# Altium project 智能家居.PrjPCB
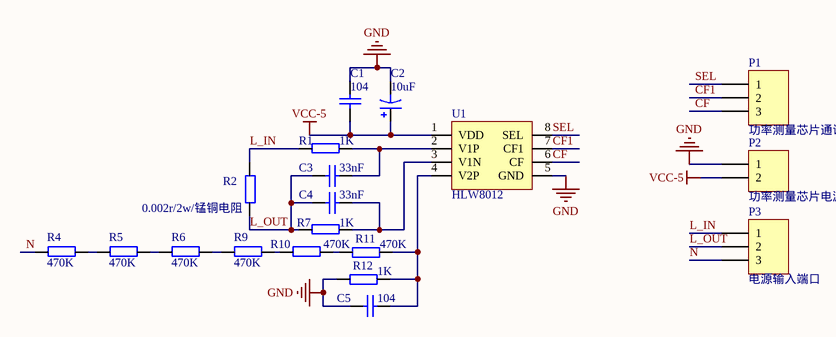
[diagram p0: 智能家居-开关-功率测量板.SchDoc]
10 sheets, 261 parts. Net scope: global (net labels, ports and power ports of the same name join across sheets).
Board files: 智能家居-开关-功率测量板.PcbDoc, 智能家居-开关-按键板.PcbDoc, 智能家居-开关-按键板(红色电容按键).PcbDoc, 智能家居-电灯-电力板.PcbDoc, 智能家居-开关-按键板(蓝色电容按键).PcbDoc, 智能家居-温湿度传感器.PcbDoc, 智能家居-电灯.PcbDoc, 智能家居-开关-电力板.PcbDoc, 智能家居-网关.PcbDoc, 智能家居-窗帘-电力板.PcbDoc, 智能家居-窗帘.PcbDoc, 智能家居-窗帘-控制板.PcbDoc, 智能家居-电灯-主控板.PcbDoc, 智能家居-开关-主控板.PcbDoc
Sheets:
  智能家居-开关-功率测量板.SchDoc
  智能家居-电灯-电力板.SchDoc
  智能家居-电灯-主控板.SchDoc
  智能家居-网关.SchDoc
  智能家居-温湿度传感器.SchDoc
  智能家居-窗帘-电力板.SchDoc
  智能家居-窗帘.SchDoc
  智能家居-窗帘-控制板.SchDoc
  智能家居-开关-电力板.SchDoc
  智能家居-开关-主控板.SchDoc

## Sheet 智能家居-开关-功率测量板.SchDoc
size A4

### Parts
(Parts that share a designator on the sheet are numbered #1, #2 ... from top to bottom, then left to right.)
C1#1  value 104  [0.1UF]  (hidden comment: Cap)
C2#1  value 10uF  [CD5]  (hidden comment: Cap Pol1)
C3#1  value 33nF  [150PF]  (hidden comment: Cap)
C4#1  value 33nF  [150PF]  (hidden comment: Cap)
C5#1  value 104  [0.1UF]  (hidden comment: Cap)
P1#1  功率测量芯片通讯端口  [DG1283]
P2#1  功率测量芯片电源端口  [DG1282]
P3#1  电源输入端口  [JK128-500-3P]
R1#1  1K  [AXIAL-0.3]
R2#1  0.002r/2w/锰铜电阻  [3216]
R4  470K  [AXIAL-0.3]
R5#1  470K  [AXIAL-0.3]
R6#1  470K  [AXIAL-0.3]
R7#1  1K  [AXIAL-0.3]
R9#1  470K  [AXIAL-0.3]
R10#1  470K  [AXIAL-0.3]
R11#1  470K  [AXIAL-0.3]
R12#1  1K  [AXIAL0.3]
U1#1  HLW8012  [SOP-8]

### Nets
GND: C1#1.1 C2#1.2 C5#1.1 P2#1.1 R12#1.1 U1#1.5(GND)
VCC-5: C1#1.2 C2#1.1 P2#1.2 U1#1.1(VDD)
CF: P1#1.3 U1#1.6(CF)
CF1: P1#1.2 U1#1.7(CF1)
L_IN: P3#1.1 R1#1.2 R2#1.2
L_OUT: C3#1.2 C4#1.1 P3#1.2 R2#1.1 R7#1.2
N: P3#1.3 R4.2
SEL: P1#1.1 U1#1.8(SEL)  [project net KM2]
NetC3#1_1: C3#1.1 R1#1.1 U1#1.2(V1P)
NetC4#1_2: C4#1.2 R7#1.1 U1#1.3(V1N)
NetC5#1_2: C5#1.2 R11#1.2 R12#1.2 U1#1.4(V2P)
NetR4_1: R4.1 R5#1.2
NetR5#1_1: R5#1.1 R6#1.2
NetR6#1_1: R6#1.1 R9#1.2
NetR9#1_1: R9#1.1 R10#1.2
NetR10#1_1: R10#1.1 R11#1.1

### Library data of the parts
C1#1 C3#1 C4#1 C5#1 = Cap: Capacitor; Published: 8-Jun-2000; LatestRevisionDate: 17-Jul-2002; LatestRevisionNote: Re-released for DXP Platform.; PackageReference: RAD-0.3; Publisher: Altium Limited; PackageDescription: Radial Cap, Thru-Hole; 2 Leads; 0.3 in Pin Spacing
C2#1 = Cap Pol1: Polarized Capacitor (Radial); Published: 8-Jun-2000; LatestRevisionDate: 17-Jul-2002; LatestRevisionNote: Re-released for DXP Platform.; PackageReference: RB7.6-15; Publisher: Altium Limited; PackageDescription: Polarized Capacitor (Radial); 2 Leads
P1#1 P3#1 = Header 3: Header, 3-Pin; LatestRevisionDate: 17-Jul-2002; LatestRevisionNote: Re-released for DXP Platform.; Publisher: Altium Limited
P2#1 = Header 2: Header, 2-Pin; LatestRevisionDate: 17-Jul-2002; LatestRevisionNote: Re-released for DXP Platform.; Publisher: Altium Limited
R1#1 R2#1 R4 R5#1 R6#1 R7#1 R9#1 R10#1 R11#1 R12#1 = R

## Sheet 智能家居-电灯-电力板.SchDoc
size A4
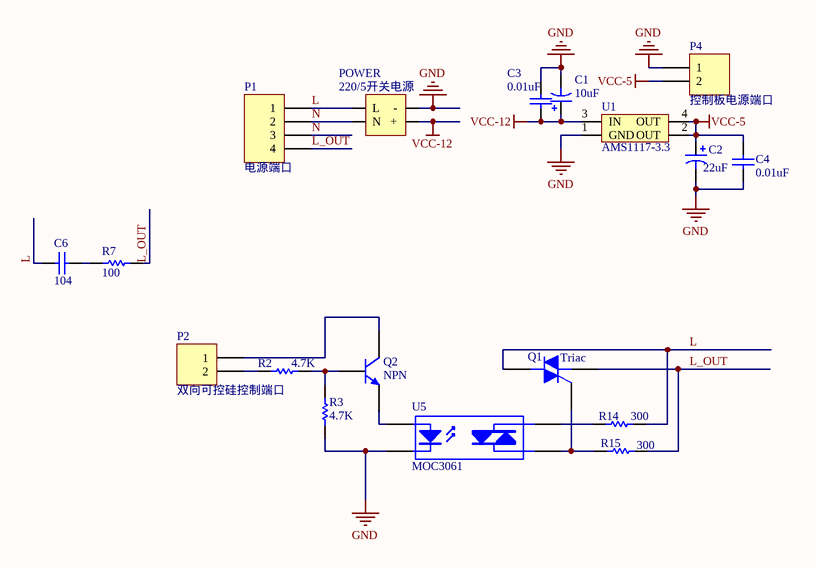
[diagram p1: 智能家居-电灯-电力板.SchDoc]

### Parts
(Parts that share a designator on the sheet are numbered #1, #2 ... from top to bottom, then left to right.)
C1#2  value 10uF  [CD5]  (hidden comment: Cap Pol1)
C2#2  value 22uF  [CD5]  (hidden comment: Cap Pol1)
C3#2  0.01uF  [0.1UF]
C4#2  0.01uF  [0.1UF]
C6#1  value 104  [0.1UF/275V]  (hidden comment: Cap)
P1#2  电源端口  [JK128-500-4P]
P2#2  双向可控硅控制端口  [TJC3-2A]
P4#1  控制板电源端口  [TJC3-2A]
POWER#1  220/5开关电源  [220/5开关电源]
Q1  Triac  [TO-220(2)]
Q2#1  NPN  [TO-92D]
R2#2  4.7K  [AXIAL0.3]
R3#1  4.7K  [AXIAL0.3]
R7#2  100  [AXIAL0.3]
R14#1  300  [AXIAL0.3]
R15#1  300  [AXIAL0.3]
U1#2  AMS1117-3.3  [AMS1117]
U5  MOC3061  [DIP-6N]

### Nets
GND: C1#2.2 C2#2.2 C3#2.2 C4#2.1 P4#1.1 POWER#1.3(-) R3#1.2 U1#2.1(GND) U5.2
VCC-5: C2#2.1 C4#2.2 P4#1.2 U1#2.2(OUT) U1#2.4(OUT)
VCC-12: C1#2.1 C3#2.1 POWER#1.4(+) U1#2.3(IN)
L: C6#1.2 P1#2.1 POWER#1.1(L) Q1.2(M2) R14#1.1
L_OUT: P1#2.4 Q1.1(M1) R7#2.1 R15#1.1
N: P1#2.2 P1#2.3 POWER#1.2(N)
NetC6#1_1: C6#1.1 R7#2.2
NetP2#2_1: P2#2.1 Q2#1.3(C)
NetP2#2_2: P2#2.2 R2#2.1
NetQ1_3: Q1.3(G) R15#1.2 U5.4(A/K)
NetQ2#1_1: Q2#1.1(E) U5.1
NetQ2#1_2: Q2#1.2(B) R2#2.2 R3#1.1
NetR14#1_2: R14#1.2 U5.6

### Library data of the parts
C1#2 C2#2 = Cap Pol1: Polarized Capacitor (Radial); Published: 8-Jun-2000; LatestRevisionDate: 17-Jul-2002; LatestRevisionNote: Re-released for DXP Platform.; PackageReference: RB7.6-15; Publisher: Altium Limited; PackageDescription: Polarized Capacitor (Radial); 2 Leads
C3#2 C4#2 C6#1 = Cap: Capacitor; Published: 8-Jun-2000; LatestRevisionDate: 17-Jul-2002; LatestRevisionNote: Re-released for DXP Platform.; Publisher: Altium Limited; PackageDescription: Radial Cap, Thru-Hole; 2 Leads; 0.3 in Pin Spacing
  C3#2 C4#2: PackageReference: 0.1UF; Value: 0.01uF
  C6#1: PackageReference: RAD-0.3
P1#2 = Header 4: Header, 4-Pin; LatestRevisionDate: 17-Jul-2002; LatestRevisionNote: Re-released for DXP Platform.; Publisher: Altium Limited
P2#2 P4#1 = Header 2: Header, 2-Pin; LatestRevisionDate: 17-Jul-2002; LatestRevisionNote: Re-released for DXP Platform.; Publisher: Altium Limited
Q1 = Triac: Silicon Bidirectional Triode Thyristor; Note: Pin 2 is electrically connected to Pin 4 (TAB); Published: 29-Sep-2000; LatestRevisionDate: 17-Jul-2002; LatestRevisionNote: Re-released for DXP Platform.; DatasheetVersion: 1999; PackageReference: 369-03; Publisher: Altium Limited; PackageDescription: TO, Thru-Hole, Vertical, Heatsink Mounted; 3 In-Line Leads; Pitch 2.28 mm; ComponentLink1Description: Manufacturer Link; ComponentLink1URL: http://www.motorola.com/
Q2#1 = NPN: NPN Bipolar Transistor; Published: 8-Jun-2000; LatestRevisionDate: 17-Jul-2002; LatestRevisionNote: Re-released for DXP Platform.; PackageReference: TO-226-AA; Publisher: Altium Limited; PackageDescription: TO, Flat Index; 3 In-Line, Axial Leads; Body Dia. 4.8mm; Leads 0.55 x 0.51 mm (max); Code_JEDEC: TO-226-AA
R2#2 R3#1 R7#2 R14#1 R15#1 = Res1: Resistor; Value: 1K; Published: 8-Jun-2000; Revision: July-2002: Re-released for DXP Platform.; Publisher: Altium Limited
U1#2 = AMS1117
U5 = OPTOTRIAC

## Sheet 智能家居-电灯-主控板.SchDoc
size A4
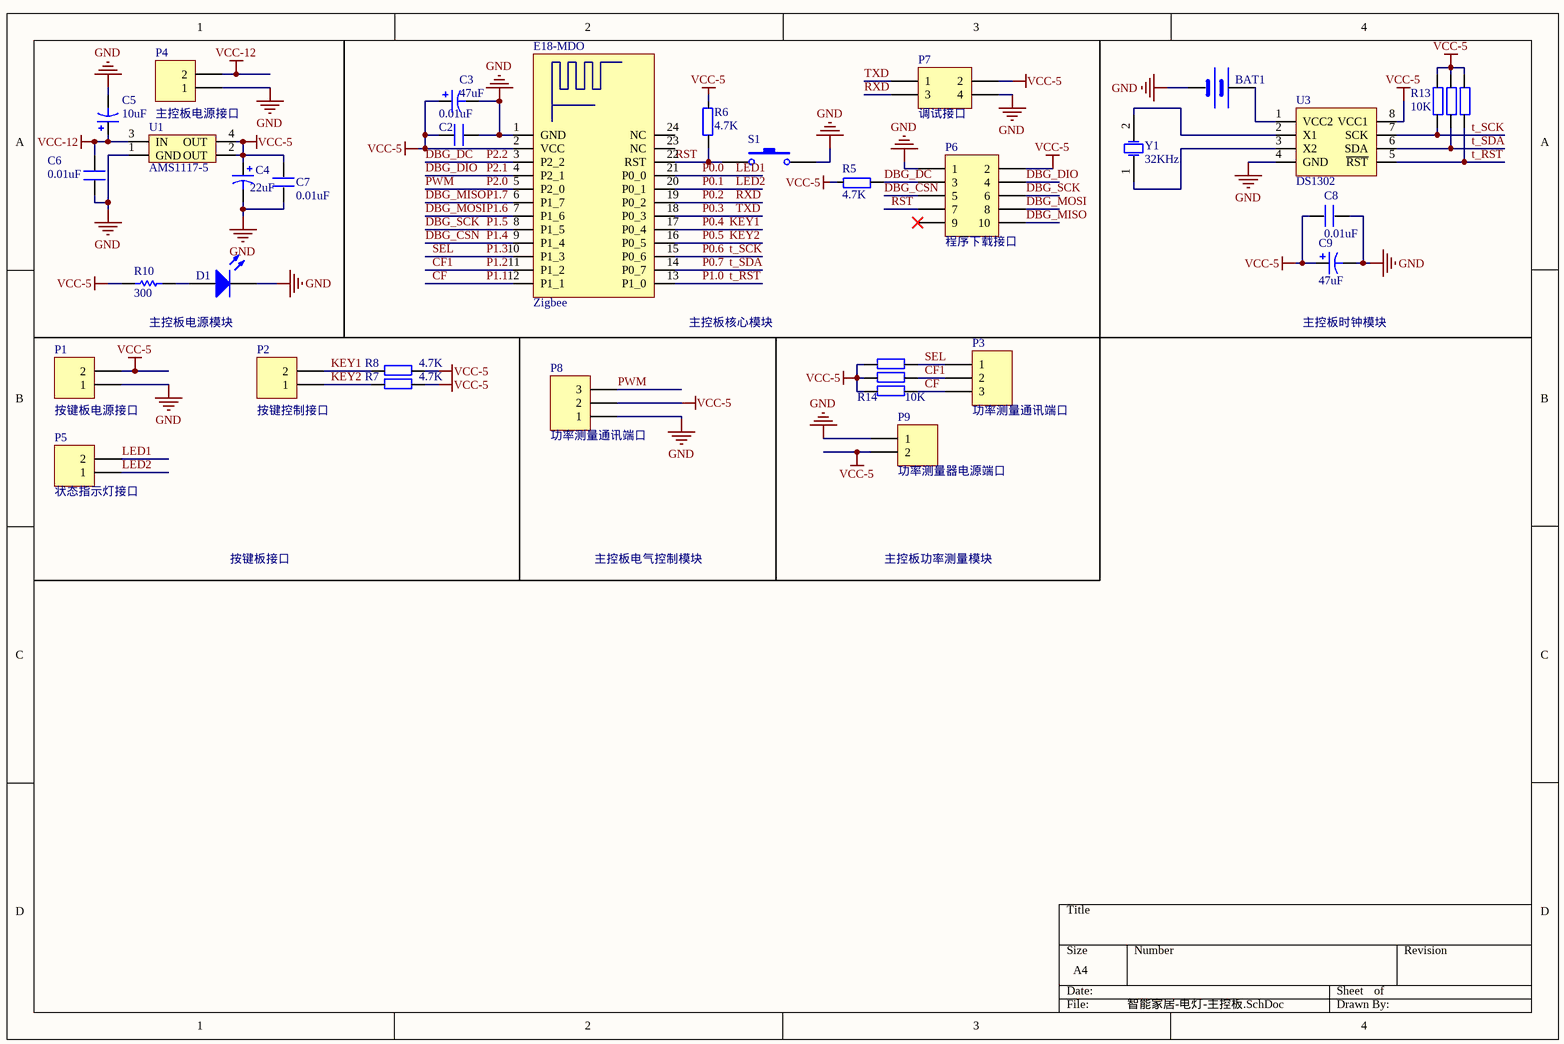
[diagram p2: 智能家居-电灯-主控板.SchDoc]

### Parts
(Parts that share a designator on the sheet are numbered #1, #2 ... from top to bottom, then left to right.)
BAT1#1  BATT  [BATM]  (value not drawn)
C2#3  0.01uF  [0.1UF]
C3#3  value 47uF  [CD5]  (hidden comment: Cap Pol1)
C4#3  value 22uF  [CD5]  (hidden comment: Cap Pol1)
C5#2  value 10uF  [CD5]  (hidden comment: Cap Pol1)
C6#2  0.01uF  [0.1UF]
C7#1  0.01uF  [0.1UF]
C8#1  0.01uF  [0.1UF]
C9#1  value 47uF  [CD5]  (hidden comment: Cap Pol1)
D1#1  LED0  [LED-3]  (value not drawn)
E18-MDO#1  Zigbee  [E18-MD0-1]
P1#3  按键板电源接口  [DG1282]
P2#3  按键控制接口  [DG1282]
P3#2  功率测量通讯端口  [DG1283]
P4#2  主控板电源接口  [DG1282]
P5#1  状态指示灯接口  [DG1282]
P6#1  程序下载接口  [HDR2X5]
P7#1  调试接口  [HDR2X2]
P8#1  功率测量通讯端口  [DG1283]
P9#1  功率测量器电源端口  [DG1282]
R5#2  4.7K  [AXIAL-0.3]
R6#2  4.7K  [AXIAL-0.3]
R7#3  4.7K  [AXIAL-0.3]
R8#1  4.7K  [AXIAL-0.3]
R10#2  value 300  [AXIAL-0.3]  (hidden comment: Res1)
R11#2  10K  [AXIAL-0.3]  (value not drawn)
R12#2  10K  [AXIAL-0.3]  (value not drawn)
R13#1  10K  [AXIAL-0.3]
R14#2  10K  [AXIAL-0.3]
R15#2  10K  [AXIAL-0.3]  (value not drawn)
R16#1  10K  [AXIAL-0.3]  (value not drawn)
S1#1  SW-PB  [KEY_M]  (value not drawn)
U1#3  AMS1117-5  [AMS1117]
U3#1  DS1302  [DIP-8N]
Y1#1  32KHz  [3216]

### Nets
GND: BAT1#1.2(GND) C2#3.2 C3#3.2 C4#3.2 C5#2.2 C6#2.1 C7#1.1 C8#1.2 C9#1.2 D1#1.2(K) E18-MDO#1.1(GND) P1#3.1 P4#2.1 P6#1.1 P7#1.4 P8#1.1 P9#1.1 S1#1.2 U1#3.1(GND) U3#1.4(GND)
VCC-5: C2#3.1 C3#3.1 C4#3.1 C7#1.2 C8#1.1 C9#1.1 E18-MDO#1.2(VCC) P1#3.2 P6#1.2 P7#1.2 P8#1.2 P9#1.2 R5#2.1 R6#2.1 R7#3.1 R8#1.1 R10#2.1 R11#2.2 R12#2.2 R13#1.2 R14#2.2 R15#2.2 R16#1.2 U1#3.2(OUT) U1#3.4(OUT) U3#1.8(VCC1)
VCC-12: C5#2.1 C6#2.2 P4#2.2 U1#3.3(IN)
CF: E18-MDO#1.12(P1_1) E18-MDO#1.16(P0_5) P2#3.1 P3#2.3 R7#3.2 R14#2.1  [also labelled KEY2, P0.5, P1.1]
CF1: E18-MDO#1.11(P1_2) P3#2.2 R15#2.1  [also labelled P1.2]
DBG_CSN: E18-MDO#1.9(P1_4) P6#1.5  [also labelled P1.4]
DBG_DC: E18-MDO#1.3(P2_2) P6#1.3 R5#2.2  [also labelled P2.2]
DBG_DIO: E18-MDO#1.4(P2_1) P6#1.4  [also labelled P2.1]
DBG_MISO: E18-MDO#1.6(P1_7) E18-MDO#1.14(P0_7) P6#1.10 R12#2.1 U3#1.6(SDA)  [also labelled P0.7, P1.7, t_SDA]  [project net Brightness]
DBG_MOSI: E18-MDO#1.7(P1_6) E18-MDO#1.13(P1_0) E18-MDO#1.17(P0_4) P2#3.2 P6#1.8 R8#1.2 R11#2.1 U3#1.5(~{RST})  [also labelled KEY1, P0.4, P1.0, P1.6, t_RST]
DBG_SCK: E18-MDO#1.8(P1_5) P6#1.6  [also labelled P1.5]
LED1: E18-MDO#1.21(P0_0) P5#1.2  [also labelled P0.0]
LED2: E18-MDO#1.20(P0_1) P5#1.1  [also labelled P0.1]
P0.2: E18-MDO#1.19(P0_2) P7#1.3  [also labelled RXD]
P0.3: E18-MDO#1.18(P0_3) P7#1.1  [also labelled TXD]
P0.6: E18-MDO#1.5(P2_0) E18-MDO#1.15(P0_6) P8#1.3 R13#1.1 U3#1.7(SCK)  [also labelled P2.0, PWM, t_SCK]  [project net DO]
P1.3: E18-MDO#1.10(P1_3) P3#2.1 R16#1.1  [also labelled SEL]  [project net KM2]
RST: E18-MDO#1.22(RST) P6#1.7 R6#2.2 S1#1.1
NetBAT1#1_1: BAT1#1.1(VCC) U3#1.1(VCC2)
NetD1#1_1: D1#1.1(A) R10#2.2
NetU3#1_2: U3#1.2(X1) Y1#1.2(OSC2)
NetU3#1_3: U3#1.3(X2) Y1#1.1(OSC1)

Not connected (* = marked no-connect by the designer): E18-MDO#1 23(NC) 24(NC); P6#1 9*

### Notes on the sheet
- 主控板电源模块
- (near E18-MDO#1) 主控板核心模块
- 主控板时钟模块
- 按键板接口
- 主控板电气控制模块
- 主控板功率测量模块

### Library data of the parts
BAT1#1 = BAT
C2#3 C6#2 C7#1 C8#1 = C
C3#3 C4#3 C5#2 C9#1 = Cap Pol1: Polarized Capacitor (Radial); Published: 8-Jun-2000; LatestRevisionDate: 17-Jul-2002; LatestRevisionNote: Re-released for DXP Platform.; PackageReference: RB7.6-15; Publisher: Altium Limited; PackageDescription: Polarized Capacitor (Radial); 2 Leads
D1#1 = LED0: Typical INFRARED GaAs LED; Published: 8-Jun-2000; LatestRevisionDate: 08-Jul-2005; LatestRevisionNote: Mech Layer 1 removed.; PackageReference: LED-0; Publisher: Altium Limited; PackageDescription: LED; 2 Leads
E18-MDO#1 = E18-MDO: Zigbee模块
P1#3 P2#3 P4#2 P5#1 P9#1 = Header 2H: Header, 2-Pin, Right Angle; LatestRevisionDate: 17-Jul-2002; LatestRevisionNote: Re-released for DXP Platform.; Publisher: Altium Limited
P3#2 P8#1 = Header 3: Header, 3-Pin; LatestRevisionDate: 17-Jul-2002; LatestRevisionNote: Re-released for DXP Platform.; Publisher: Altium Limited
P6#1 = Header 5X2: Header, 5-Pin, Dual row; LatestRevisionDate: 17-Jul-2002; LatestRevisionNote: Re-released for DXP Platform.; Publisher: Altium Limited
P7#1 = Header 2X2H: Header, 2-Pin, Dual row, Right Angle; LatestRevisionDate: 17-Jul-2002; LatestRevisionNote: Re-released for DXP Platform.; Publisher: Altium Limited
R5#2 R6#2 R7#3 R8#1 R11#2 R12#2 R13#1 R14#2 R15#2 R16#1 = R
R10#2 = Res1: Resistor; Published: 8-Jun-2000; LatestRevisionDate: 17-Jul-2002; LatestRevisionNote: Re-released for DXP Platform.; PackageReference: AXIAL-0.3; Publisher: Altium Limited; PackageDescription: Axial Device, Thru-Hole; 2 Leads; 0.3 in Pin Spacing
S1#1 = SW-PB: Switch; Published: 24-Mar-1999; LatestRevisionDate: 17-Jul-2002; LatestRevisionNote: Re-released for DXP Platform.; PackageReference: SPST-2; Publisher: Altium Limited; PackageDescription: Switch; 2 Leads
U1#3 = AMS1117
Y1#1 = XTAL: Crystal Oscillator; Published: 8-Jun-2000; LatestRevisionDate: 17-Jul-2002; LatestRevisionNote: Re-released for DXP Platform.; PackageReference: R38; Publisher: Altium Limited; PackageDescription: Crystal, Thru-Hole; 2 Leads; Body 3.1 x 8.2 mm (Dia.xH)

## Sheet 智能家居-网关.SchDoc
size A4
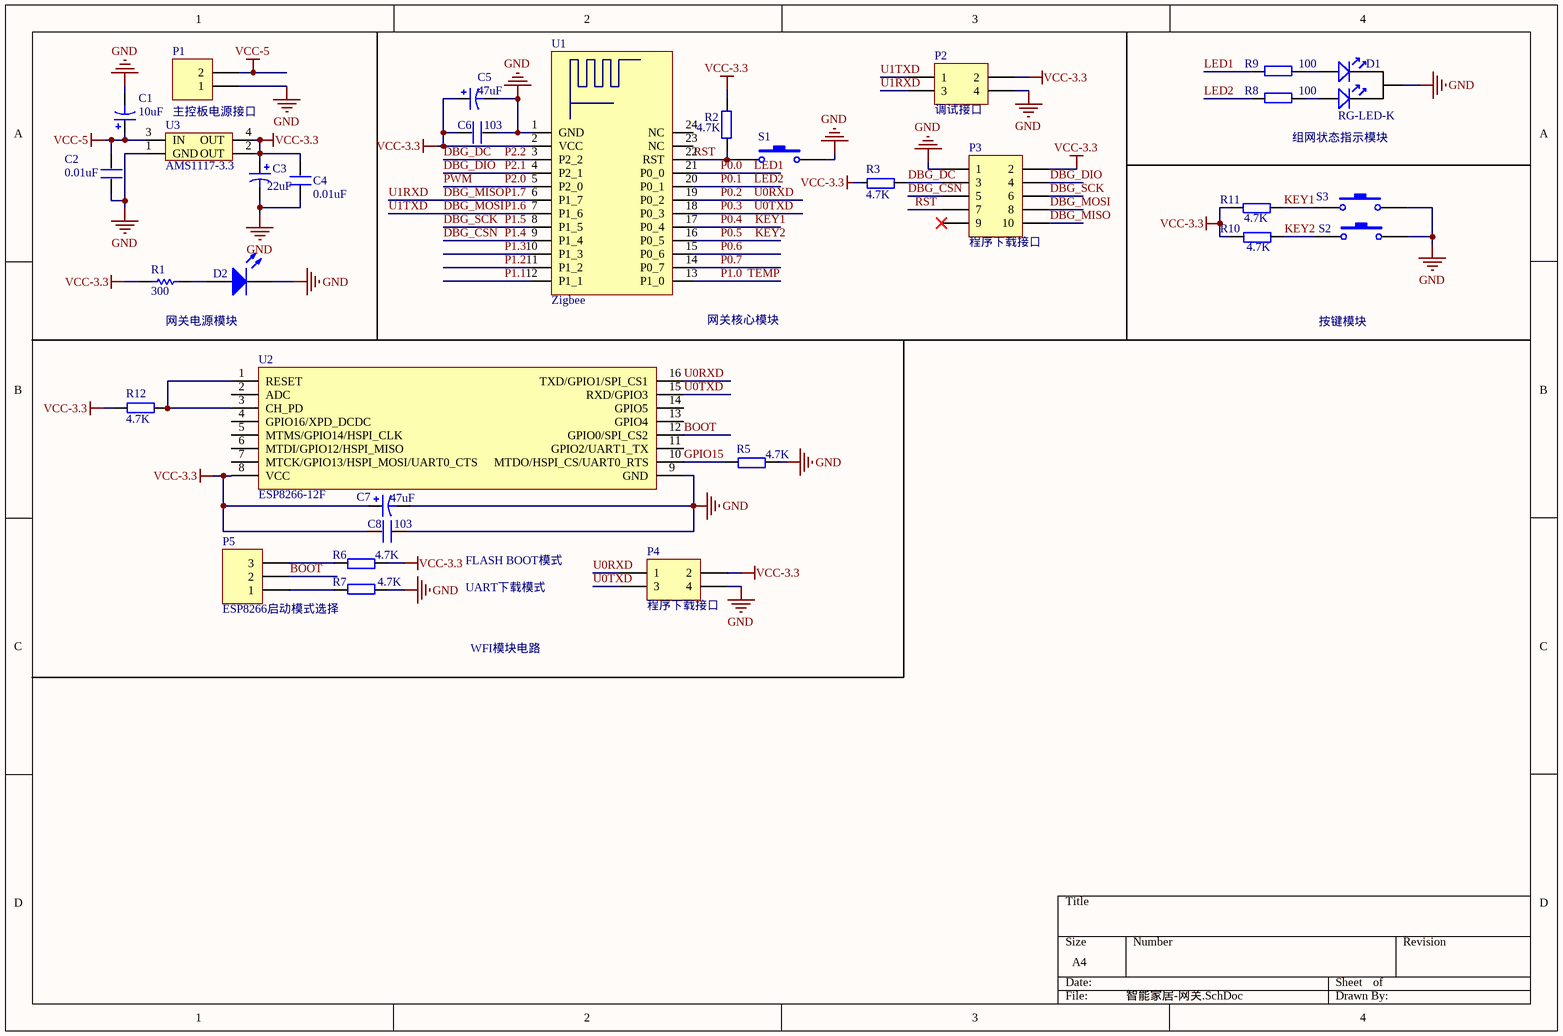
[diagram p3: 智能家居-网关.SchDoc]

### Parts
(Parts that share a designator on the sheet are numbered #1, #2 ... from top to bottom, then left to right.)
C1#3  value 10uF  [CD5]  (hidden comment: Cap Pol1)
C2#4  0.01uF  [0.1UF]
C3#4  value 22uF  [CD5]  (hidden comment: Cap Pol1)
C4#4  0.01uF  [0.1UF]
C5#3  value 47uF  [CD5]  (hidden comment: Cap Pol1)
C6#3  103  [0.1UF]
C7#2  value 47uF  [CD5]  (hidden comment: Cap Pol1)
C8#2  103  [0.1UF]
D1#2  RG-LED-K  [RG-LED]
D2#1  LED0  [LED-3]  (value not drawn)
P1#4  主控板电源接口  [DG1282]
P2#4  调试接口  [HDR2X2]
P3#3  程序下载接口  [HDR2X5]
P4#3  程序下载接口  [HDR2X2]
P5#2  ESP8266启动模式选择  [HDR1X3]
R1#2  value 300  [AXIAL-0.3]  (hidden comment: Res1)
R2#3  4.7K  [AXIAL-0.3]
R3#2  4.7K  [AXIAL-0.3]
R5#3  4.7K  [AXIAL-0.3]
R6#3  4.7K  [AXIAL-0.3]
R7#4  4.7K  [AXIAL-0.3]
R8#2  100  [AXIAL-0.3]
R9#2  100  [AXIAL-0.3]
R10#3  4.7K  [AXIAL-0.3]
R11#3  4.7K  [AXIAL-0.3]
R12#3  4.7K  [AXIAL-0.3]
S1#2  SW-PB  [KEY_M]  (value not drawn)
S2#1  SW-PB  [KEY_M]  (value not drawn)
S3  SW-PB  [KEY_M]  (value not drawn)
U1#4  Zigbee  [E18-MD0-1]
U2#1  ESP8266-12F  [ESP8266 - 12S]
U3#2  AMS1117-3.3  [AMS1117]

### Nets
GND: C1#3.2 C2#4.1 C3#4.2 C4#4.1 C5#3.2 C6#3.2 C7#2.2 C8#2.2 D1#2.2(GND) D2#1.2(K) P1#4.1 P2#4.4 P3#3.1 P4#3.4 R5#3.2 R7#4.1 S1#2.2 S2#1.2 S3.2 U1#4.1(GND) U2#1.9(GND) U3#2.1(GND)
VCC-3.3: C3#4.1 C4#4.2 C5#3.1 C6#3.1 C7#2.1 C8#2.1 P2#4.2 P3#3.2 P4#3.2 R1#2.1 R2#3.1 R3#2.1 R6#3.2 R10#3.1 R11#3.1 R12#3.2 U1#4.2(VCC) U2#1.8(VCC) U3#2.2(OUT) U3#2.4(OUT)
VCC-5: C1#3.1 C2#4.2 P1#4.2 U3#2.3(IN)
BOOT: P5#2.2 U2#1.12(GPIO0/SPI_CS2)
DBG_CSN: P3#3.5 U1#4.9(P1_4)  [also labelled P1.4]
DBG_DC: P3#3.3 R3#2.2 U1#4.3(P2_2)  [also labelled P2.2]
DBG_DIO: P3#3.4 U1#4.4(P2_1)  [also labelled P2.1]
DBG_MISO: P2#4.3 P3#3.10 U1#4.6(P1_7) U1#4.14(P0_7)  [also labelled P0.7, P1.7, U1RXD]  [project net Brightness]
DBG_MOSI: P2#4.1 P3#3.8 R11#3.2 S3.1 U1#4.7(P1_6) U1#4.13(P1_0) U1#4.17(P0_4)  [also labelled KEY1, P0.4, P1.0, P1.6, TEMP, U1TXD]
DBG_SCK: P3#3.6 U1#4.8(P1_5)  [also labelled P1.5]
GPIO15: R5#3.1 U2#1.10(MTDO/HSPI_CS/UART0_RTS)
KEY2: R10#3.2 S2#1.1 U1#4.12(P1_1) U1#4.16(P0_5)  [also labelled P0.5, P1.1]  [project net CF]
LED1: R9#2.2 U1#4.21(P0_0)  [also labelled P0.0]
LED2: R8#2.2 U1#4.20(P0_1)  [also labelled P0.1]
P0.2: P4#3.1 U1#4.19(P0_2) U2#1.16(TXD/GPIO1/SPI_CS1)  [also labelled U0RXD]
P0.3: P4#3.3 U1#4.18(P0_3) U2#1.15(RXD/GPIO3)  [also labelled U0TXD]
P0.6: U1#4.5(P2_0) U1#4.15(P0_6)  [also labelled P2.0, PWM]  [project net DO]
P1.2: U1#4.11(P1_2)  [project net CF1]
P1.3: U1#4.10(P1_3)  [project net KM2]
RST: P3#3.7 R2#3.2 S1#2.1 U1#4.22(RST)
NetD1#2_1: D1#2.1(R) R9#2.1
NetD1#2_3: D1#2.3(G) R8#2.1
NetD2#1_1: D2#1.1(A) R1#2.2
NetP5#2_1: P5#2.1 R7#4.2
NetP5#2_3: P5#2.3 R6#3.1
NetR12#3_1: R12#3.1 U2#1.1(RESET) U2#1.3(CH_PD)

Not connected (* = marked no-connect by the designer): P3#3 9*; U1#4 23(NC) 24(NC); U2#1 2(ADC) 4(GPIO16/XPD_DCDC) 5(MTMS/GPIO14/HSPI_CLK) 6(MTDI/GPIO12/HSPI_MISO) 7(MTCK/GPIO13/HSPI_MOSI/UART0_CTS) 11(GPIO2/UART1_TX) 13(GPIO4) 14(GPIO5)

### Notes on the sheet
- 组网状态指示模块
- 网关电源模块
- 网关核心模块
- 按键模块
- FLASH BOOT模式
- UART下载模式
- WFI模块电路

### Library data of the parts
C1#3 C3#4 C5#3 C7#2 = Cap Pol1: Polarized Capacitor (Radial); Published: 8-Jun-2000; LatestRevisionDate: 17-Jul-2002; LatestRevisionNote: Re-released for DXP Platform.; PackageReference: RB7.6-15; Publisher: Altium Limited; PackageDescription: Polarized Capacitor (Radial); 2 Leads
C2#4 C4#4 C6#3 C8#2 = C
D2#1 = LED0: Typical INFRARED GaAs LED; Published: 8-Jun-2000; LatestRevisionDate: 08-Jul-2005; LatestRevisionNote: Mech Layer 1 removed.; PackageReference: LED-0; Publisher: Altium Limited; PackageDescription: LED; 2 Leads
P1#4 = Header 2H: Header, 2-Pin, Right Angle; LatestRevisionDate: 17-Jul-2002; LatestRevisionNote: Re-released for DXP Platform.; Publisher: Altium Limited
P2#4 P4#3 = Header 2X2H: Header, 2-Pin, Dual row, Right Angle; LatestRevisionDate: 17-Jul-2002; LatestRevisionNote: Re-released for DXP Platform.; Publisher: Altium Limited
P3#3 = Header 5X2: Header, 5-Pin, Dual row; LatestRevisionDate: 17-Jul-2002; LatestRevisionNote: Re-released for DXP Platform.; Publisher: Altium Limited
P5#2 = Header 3: Header, 3-Pin; LatestRevisionDate: 17-Jul-2002; LatestRevisionNote: Re-released for DXP Platform.; Publisher: Altium Limited
R1#2 = Res1: Resistor; Published: 8-Jun-2000; LatestRevisionDate: 17-Jul-2002; LatestRevisionNote: Re-released for DXP Platform.; PackageReference: AXIAL-0.3; Publisher: Altium Limited; PackageDescription: Axial Device, Thru-Hole; 2 Leads; 0.3 in Pin Spacing
R2#3 R3#2 R5#3 R6#3 R7#4 R8#2 R9#2 R10#3 R11#3 R12#3 = R
S1#2 S2#1 S3 = SW-PB: Switch; Published: 24-Mar-1999; LatestRevisionDate: 17-Jul-2002; LatestRevisionNote: Re-released for DXP Platform.; PackageReference: SPST-2; Publisher: Altium Limited; PackageDescription: Switch; 2 Leads
U1#4 = E18-MDO: Zigbee模块
U2#1 = ESP8266_12S
U3#2 = AMS1117

## Sheet 智能家居-温湿度传感器.SchDoc
size A4
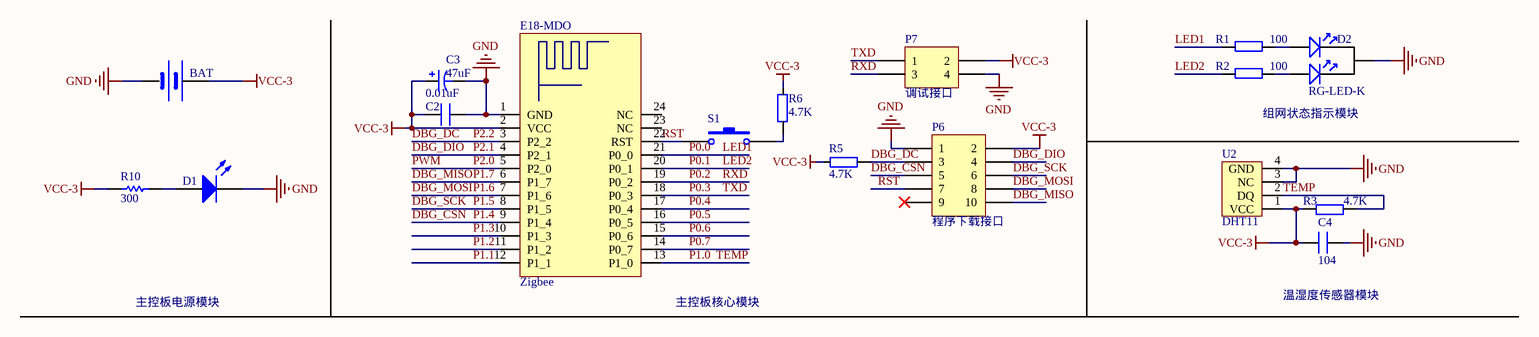
[diagram p4: 智能家居-温湿度传感器.SchDoc]

### Parts
(Parts that share a designator on the sheet are numbered #1, #2 ... from top to bottom, then left to right.)
BAT#1  BATT  [BATM]  (value not drawn)
C2#5  0.01uF  [0.1UF]
C3#5  value 47uF  [CD5]  (hidden comment: Cap Pol1)
C4#5  104  [0.1UF]
D1#3  LED0  [LED-3]  (value not drawn)
D2#2  RG-LED-K  [RG-LED]
E18-MDO#2  Zigbee  [E18-MD0-1]
P6#2  程序下载接口  [HDR2X5]
P7#2  调试接口  [HDR2X2]
R1#3  100  [AXIAL-0.3]
R2#4  100  [AXIAL-0.3]
R3#3  4.7K  [AXIAL-0.3]
R5#4  4.7K  [AXIAL-0.3]
R6#4  4.7K  [AXIAL-0.3]
R10#4  value 300  [AXIAL-0.3]  (hidden comment: Res1)
S1#3  SW-PB  [KEY_M]  (value not drawn)
U2#2  DHT11  [HDR1X4]

### Nets
GND: BAT#1.2(GND) C2#5.2 C3#5.2 C4#5.1 D1#3.2(K) D2#2.2(GND) E18-MDO#2.1(GND) P6#2.1 P7#2.4 U2#2.3(NC) U2#2.4(GND)
VCC-3: BAT#1.1(VCC) C2#5.1 C3#5.1 C4#5.2 E18-MDO#2.2(VCC) P6#2.2 P7#2.2 R3#3.1 R5#4.1 R6#4.1 R10#4.1 U2#2.1(VCC)
DBG_CSN: E18-MDO#2.9(P1_4) P6#2.5  [also labelled P1.4]
DBG_DC: E18-MDO#2.3(P2_2) P6#2.3 R5#4.2  [also labelled P2.2]
DBG_DIO: E18-MDO#2.4(P2_1) P6#2.4  [also labelled P2.1]
DBG_MISO: E18-MDO#2.6(P1_7) E18-MDO#2.14(P0_7) P6#2.10  [also labelled P0.7, P1.7]  [project net Brightness]
DBG_MOSI: E18-MDO#2.7(P1_6) E18-MDO#2.13(P1_0) E18-MDO#2.17(P0_4) P6#2.8 R3#3.2 U2#2.2(DQ)  [also labelled P0.4, P1.0, P1.6, TEMP]
DBG_SCK: E18-MDO#2.8(P1_5) P6#2.6  [also labelled P1.5]
LED1: E18-MDO#2.21(P0_0) R1#3.2  [also labelled P0.0]
LED2: E18-MDO#2.20(P0_1) R2#4.2  [also labelled P0.1]
P0.2: E18-MDO#2.19(P0_2) P7#2.3  [also labelled RXD]
P0.3: E18-MDO#2.18(P0_3) P7#2.1  [also labelled TXD]
P0.5: E18-MDO#2.12(P1_1) E18-MDO#2.16(P0_5)  [also labelled P1.1]  [project net CF]
P0.6: E18-MDO#2.5(P2_0) E18-MDO#2.15(P0_6)  [also labelled P2.0, PWM]  [project net DO]
P1.2: E18-MDO#2.11(P1_2)  [project net CF1]
P1.3: E18-MDO#2.10(P1_3)  [project net KM2]
RST: E18-MDO#2.22(RST) P6#2.7 S1#3.1
NetD1#3_1: D1#3.1(A) R10#4.2
NetD2#2_1: D2#2.1(R) R1#3.1
NetD2#2_3: D2#2.3(G) R2#4.1
NetR6#4_2: R6#4.2 S1#3.2

Not connected (* = marked no-connect by the designer): E18-MDO#2 23(NC) 24(NC); P6#2 9*

### Notes on the sheet
- 组网状态指示模块
- (near C4#5) 温湿度传感器模块
- 主控板电源模块
- (near E18-MDO#2) 主控板核心模块

### Library data of the parts
BAT#1 = BAT
C2#5 C4#5 = C
C3#5 = Cap Pol1: Polarized Capacitor (Radial); Published: 8-Jun-2000; LatestRevisionDate: 17-Jul-2002; LatestRevisionNote: Re-released for DXP Platform.; PackageReference: RB7.6-15; Publisher: Altium Limited; PackageDescription: Polarized Capacitor (Radial); 2 Leads
D1#3 = LED0: Typical INFRARED GaAs LED; Published: 8-Jun-2000; LatestRevisionDate: 08-Jul-2005; LatestRevisionNote: Mech Layer 1 removed.; PackageReference: LED-0; Publisher: Altium Limited; PackageDescription: LED; 2 Leads
E18-MDO#2 = E18-MDO: Zigbee模块
P6#2 = Header 5X2: Header, 5-Pin, Dual row; LatestRevisionDate: 17-Jul-2002; LatestRevisionNote: Re-released for DXP Platform.; Publisher: Altium Limited
P7#2 = Header 2X2H: Header, 2-Pin, Dual row, Right Angle; LatestRevisionDate: 17-Jul-2002; LatestRevisionNote: Re-released for DXP Platform.; Publisher: Altium Limited
R1#3 R2#4 R3#3 R5#4 R6#4 = R
R10#4 = Res1: Resistor; Published: 8-Jun-2000; LatestRevisionDate: 17-Jul-2002; LatestRevisionNote: Re-released for DXP Platform.; PackageReference: AXIAL-0.3; Publisher: Altium Limited; PackageDescription: Axial Device, Thru-Hole; 2 Leads; 0.3 in Pin Spacing
S1#3 = SW-PB: Switch; Published: 24-Mar-1999; LatestRevisionDate: 17-Jul-2002; LatestRevisionNote: Re-released for DXP Platform.; PackageReference: SPST-2; Publisher: Altium Limited; PackageDescription: Switch; 2 Leads
U2#2 = DHT11: 数字温湿度传感器

## Sheet 智能家居-窗帘-电力板.SchDoc
size A4
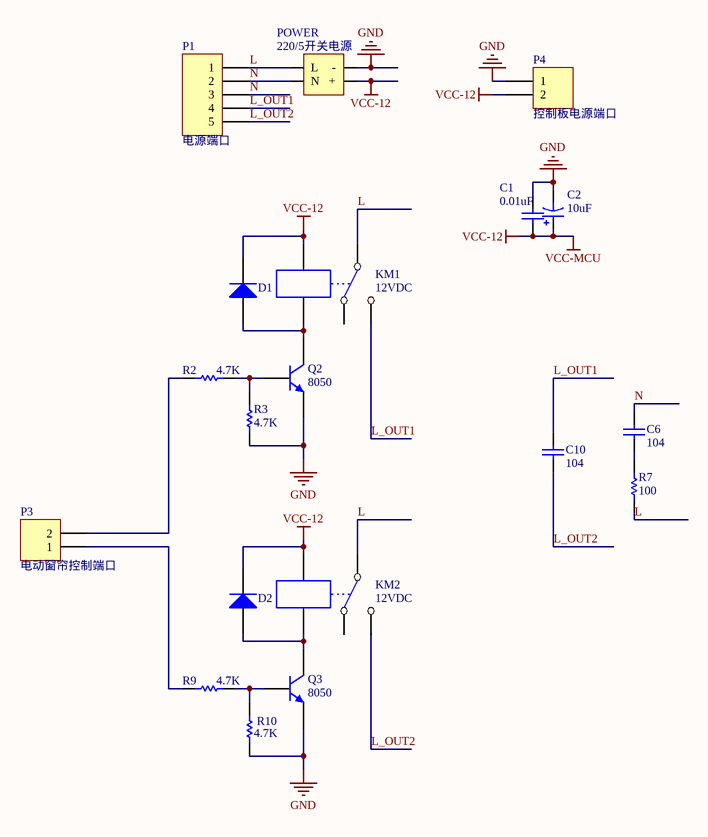
[diagram p5: 智能家居-窗帘-电力板.SchDoc]

### Parts
(Parts that share a designator on the sheet are numbered #1, #2 ... from top to bottom, then left to right.)
C1#4  0.01uF  [0.1UF]
C2#6  value 10uF  [CD5]  (hidden comment: Cap Pol1)
C6#4  value 104  [0.1UF/275V]  (hidden comment: Cap)
C10#1  value 104  [0.1UF/275V]  (hidden comment: Cap)
D1#4  Diode  [DIODE]  (value not drawn)
D2#3  Diode  [DIODE]  (value not drawn)
KM1  12VDC  [SRD_RELAY]
KM2  12VDC  [SRD_RELAY]
P1#5  电源端口  [JK128-500-5P]
P3#4  电动窗帘控制端口  [TJC3-2A]
P4#4  控制板电源端口  [TJC3-2A]
POWER#2  220/5开关电源  [220/5开关电源]
Q2#2  8050  [TO-92D]
Q3  8050  [TO-92D]
R2#5  4.7K  [AXIAL0.3]
R3#4  4.7K  [AXIAL0.3]
R7#5  100  [AXIAL0.3]
R9#3  4.7K  [AXIAL0.3]
R10#5  4.7K  [AXIAL0.3]

### Nets
GND: C1#4.2 C2#6.2 P4#4.1 POWER#2.3(-) Q2#2.1(E) Q3.1(E) R3#4.2 R10#5.2
VCC-12: C1#4.1 C2#6.1 D1#4.2(K) D2#3.2(K) KM1.1 KM2.1 P4#4.2 POWER#2.4(+)  [also labelled VCC-MCU]
L: KM1.5(COM) KM2.5(COM) P1#5.1 POWER#2.1(L) R7#5.1
L_OUT1: C10#1.2 KM1.3 P1#5.4
L_OUT2: C10#1.1 KM2.3 P1#5.5
N: C6#4.2 P1#5.2 P1#5.3 POWER#2.2(N)
NetC6#4_1: C6#4.1 R7#5.2
NetD1#4_1: D1#4.1(A) KM1.4 Q2#2.3(C)
NetD2#3_1: D2#3.1(A) KM2.4 Q3.3(C)
NetP3#4_1: P3#4.1 R9#3.1
NetP3#4_2: P3#4.2 R2#5.1
NetQ2#2_2: Q2#2.2(B) R2#5.2 R3#4.1
NetQ3_2: Q3.2(B) R9#3.2 R10#5.1

Not connected (* = marked no-connect by the designer): KM1 2; KM2 2

### Library data of the parts
C1#4 C6#4 C10#1 = Cap: Capacitor; Published: 8-Jun-2000; LatestRevisionDate: 17-Jul-2002; LatestRevisionNote: Re-released for DXP Platform.; Publisher: Altium Limited; PackageDescription: Radial Cap, Thru-Hole; 2 Leads; 0.3 in Pin Spacing
  C1#4: PackageReference: 0.1UF; Value: 0.01uF
  C6#4 C10#1: PackageReference: RAD-0.3
C2#6 = Cap Pol1: Polarized Capacitor (Radial); Published: 8-Jun-2000; LatestRevisionDate: 17-Jul-2002; LatestRevisionNote: Re-released for DXP Platform.; PackageReference: RB7.6-15; Publisher: Altium Limited; PackageDescription: Polarized Capacitor (Radial); 2 Leads
D1#4 D2#3 = Diode: Default Diode; Published: 8-Jun-2000; LatestRevisionDate: 17-Jul-2002; LatestRevisionNote: Re-released for DXP Platform.; PackageVersion: Sep-1996; PackageReference: SMC; Publisher: Altium Limited; PackageDescription: DO-214-AB/SMC; 2 C-Bend Leads; Body 7.9 x 5.9 mm, inc. leads (LxW); Code_JEDEC: DO-214-AB
KM1 KM2 = SRD-12VDC
P1#5 = Header 5: Header, 5-Pin; LatestRevisionDate: 17-Jul-2002; LatestRevisionNote: Re-released for DXP Platform.; Publisher: Altium Limited
P3#4 P4#4 = Header 2: Header, 2-Pin; LatestRevisionDate: 17-Jul-2002; LatestRevisionNote: Re-released for DXP Platform.; Publisher: Altium Limited
Q2#2 Q3 = NPN: NPN Bipolar Transistor; Published: 8-Jun-2000; LatestRevisionDate: 17-Jul-2002; LatestRevisionNote: Re-released for DXP Platform.; PackageReference: TO-226-AA; Publisher: Altium Limited; PackageDescription: TO, Flat Index; 3 In-Line, Axial Leads; Body Dia. 4.8mm; Leads 0.55 x 0.51 mm (max); Code_JEDEC: TO-226-AA
R2#5 R3#4 R7#5 R9#3 R10#5 = Res1: Resistor; Value: 1K; Published: 8-Jun-2000; Revision: July-2002: Re-released for DXP Platform.; Publisher: Altium Limited

## Sheet 智能家居-窗帘.SchDoc
size A4
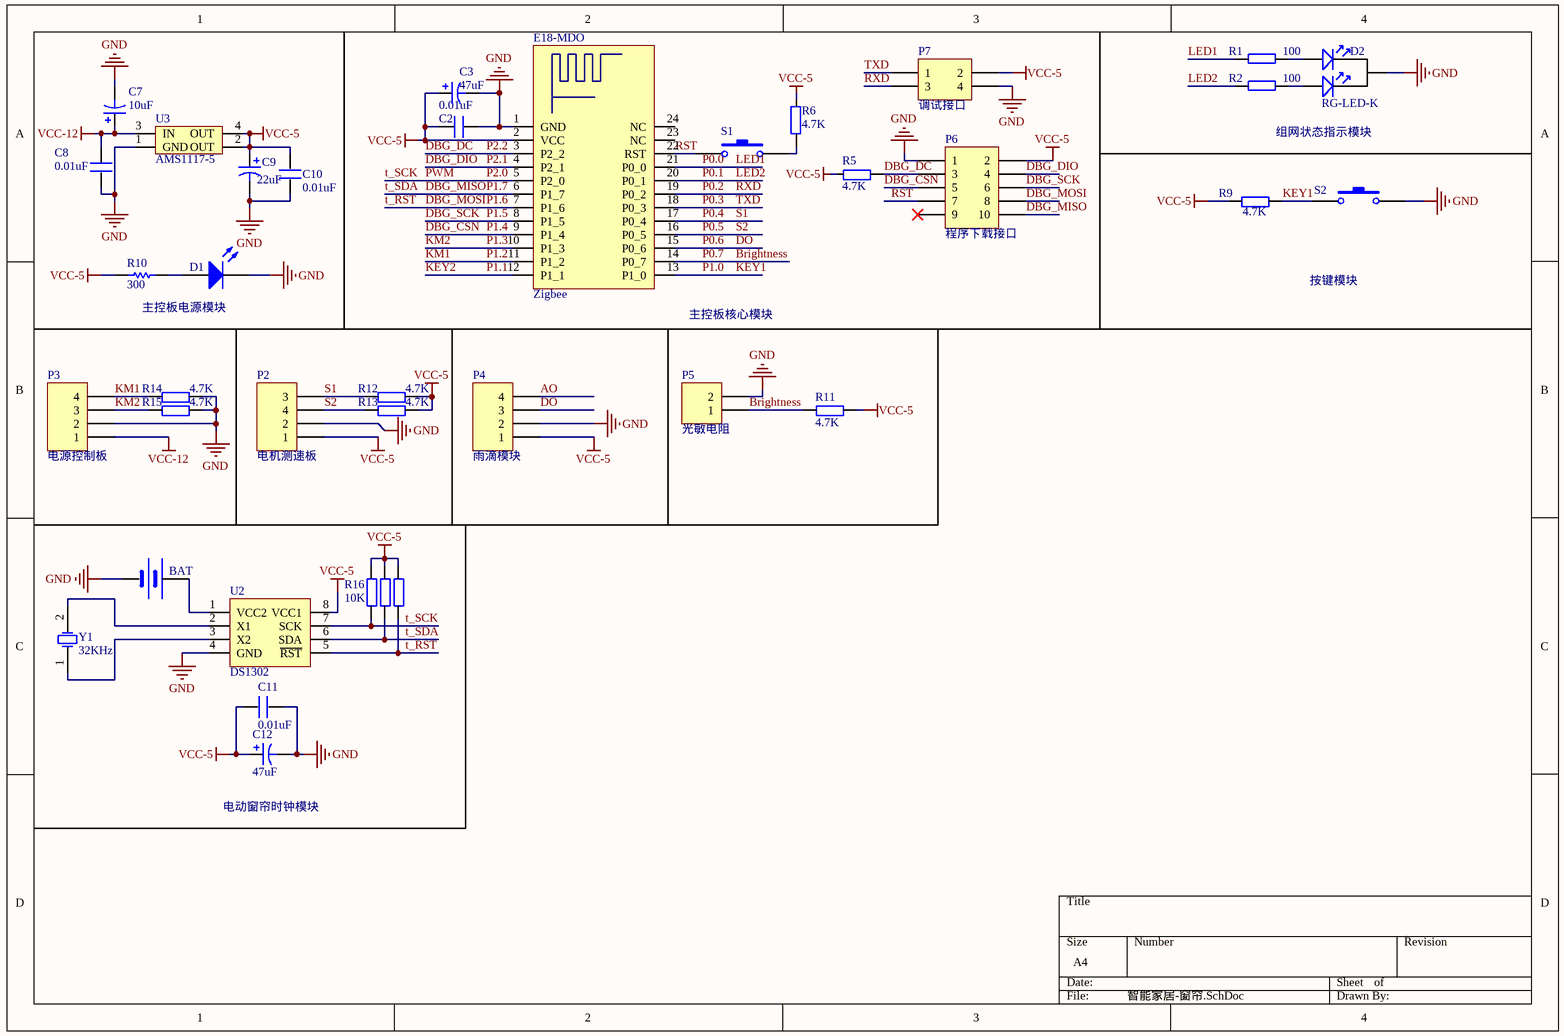
[diagram p6: 智能家居-窗帘.SchDoc]

### Parts
(Parts that share a designator on the sheet are numbered #1, #2 ... from top to bottom, then left to right.)
BAT#2  BATT  [BATM]  (value not drawn)
C2#7  0.01uF  [0.1UF]
C3#6  value 47uF  [CD5]  (hidden comment: Cap Pol1)
C7#3  value 10uF  [CD5]  (hidden comment: Cap Pol1)
C8#3  0.01uF  [0.1UF]
C9#2  value 22uF  [CD5]  (hidden comment: Cap Pol1)
C10#2  0.01uF  [0.1UF]
C11#1  0.01uF  [0.1UF]
C12#1  value 47uF  [CD5]  (hidden comment: Cap Pol1)
D1#5  LED0  [LED-3]  (value not drawn)
D2#4  RG-LED-K  [RG-LED]
E18-MDO#3  Zigbee  [E18-MD0-1]
P2#5  电机测速板  [HDR1X4]
P3#5  电源控制板  [HDR1X4]
P4#5  雨滴模块  [DG1284]
P5#3  光敏电阻  [HDR1X2]
P6#3  程序下载接口  [HDR2X5]
P7#3  调试接口  [HDR2X2]
R1#4  100  [AXIAL-0.3]
R2#6  100  [AXIAL-0.3]
R5#5  4.7K  [AXIAL-0.3]
R6#5  4.7K  [AXIAL-0.3]
R9#4  4.7K  [AXIAL-0.3]
R10#6  value 300  [AXIAL-0.3]  (hidden comment: Res1)
R11#4  4.7K  [AXIAL-0.3]
R12#4  4.7K  [AXIAL-0.4]
R13#2  4.7K  [AXIAL-0.4]
R14#3  4.7K  [AXIAL-0.3]
R15#3  4.7K  [AXIAL-0.3]
R16#2  10K  [AXIAL-0.3]
R17#1  10K  [AXIAL-0.3]  (value not drawn)
R18#1  10K  [AXIAL-0.3]  (value not drawn)
S1#4  SW-PB  [KEY_M]  (value not drawn)
S2#2  SW-PB  [KEY_M]  (value not drawn)
U2#3  DS1302  [DIP-8N]
U3#3  AMS1117-5  [AMS1117]
Y1#2  32KHz  [3216]

### Nets
GND: BAT#2.2(GND) C2#7.2 C3#6.2 C7#3.2 C8#3.1 C9#2.2 C10#2.1 C11#1.2 C12#1.2 D1#5.2(K) D2#4.2(GND) E18-MDO#3.1(GND) P2#5.2 P3#5.2 P4#5.2 P5#3.2 P6#3.1 P7#3.4 R14#3.2 R15#3.2 S2#2.2 U2#3.4(GND) U3#3.1(GND)
VCC-5: C2#7.1 C3#6.1 C9#2.1 C10#2.2 C11#1.1 C12#1.1 E18-MDO#3.2(VCC) P2#5.1 P4#5.1 P6#3.2 P7#3.2 R5#5.1 R6#5.1 R9#4.1 R10#6.1 R11#4.2 R12#4.2 R13#2.2 R16#2.2 R17#1.2 R18#1.2 U2#3.8(VCC1) U3#3.2(OUT) U3#3.4(OUT)
VCC-12: C7#3.1 C8#3.2 P3#5.1 U3#3.3(IN)
AO: P4#5.4
Brightness: E18-MDO#3.6(P1_7) E18-MDO#3.14(P0_7) P5#3.1 P6#3.10 R11#4.1 R17#1.1 U2#3.6(SDA)  [also labelled DBG_MISO, P0.7, P1.7, t_SDA]
DBG_CSN: E18-MDO#3.9(P1_4) P6#3.5  [also labelled P1.4]
DBG_DC: E18-MDO#3.3(P2_2) P6#3.3 R5#5.2  [also labelled P2.2]
DBG_DIO: E18-MDO#3.4(P2_1) P6#3.4  [also labelled P2.1]
DBG_MOSI: E18-MDO#3.7(P1_6) E18-MDO#3.13(P1_0) E18-MDO#3.17(P0_4) P2#5.3 P6#3.8 R9#4.2 R12#4.1 R18#1.1 S2#2.1 U2#3.5(~{RST})  [also labelled KEY1, P0.4, P1.0, P1.6, S1, t_RST]
DBG_SCK: E18-MDO#3.8(P1_5) P6#3.6  [also labelled P1.5]
DO: E18-MDO#3.5(P2_0) E18-MDO#3.15(P0_6) P4#5.3 R16#2.1 U2#3.7(SCK)  [also labelled P0.6, P2.0, PWM, t_SCK]
KEY2: E18-MDO#3.12(P1_1) E18-MDO#3.16(P0_5) P2#5.4 R13#2.1  [also labelled P0.5, P1.1, S2]  [project net CF]
KM1: E18-MDO#3.11(P1_2) P3#5.4 R14#3.1  [also labelled P1.2]  [project net CF1]
KM2: E18-MDO#3.10(P1_3) P3#5.3 R15#3.1  [also labelled P1.3]
LED1: E18-MDO#3.21(P0_0) R1#4.2  [also labelled P0.0]
LED2: E18-MDO#3.20(P0_1) R2#6.2  [also labelled P0.1]
P0.2: E18-MDO#3.19(P0_2) P7#3.3  [also labelled RXD]
P0.3: E18-MDO#3.18(P0_3) P7#3.1  [also labelled TXD]
RST: E18-MDO#3.22(RST) P6#3.7 S1#4.1
NetBAT#2_1: BAT#2.1(VCC) U2#3.1(VCC2)
NetD1#5_1: D1#5.1(A) R10#6.2
NetD2#4_1: D2#4.1(R) R1#4.1
NetD2#4_3: D2#4.3(G) R2#6.1
NetR6#5_2: R6#5.2 S1#4.2
NetU2#3_2: U2#3.2(X1) Y1#2.2(OSC2)
NetU2#3_3: U2#3.3(X2) Y1#2.1(OSC1)

Not connected (* = marked no-connect by the designer): E18-MDO#3 23(NC) 24(NC); P6#3 9*

### Notes on the sheet
- 组网状态指示模块
- 主控板电源模块
- 按键模块
- 主控板核心模块
- (near C12#1) 电动窗帘时钟模块

### Library data of the parts
BAT#2 = BAT
C2#7 C8#3 C10#2 C11#1 = C
C3#6 C7#3 C9#2 C12#1 = Cap Pol1: Polarized Capacitor (Radial); Published: 8-Jun-2000; LatestRevisionDate: 17-Jul-2002; LatestRevisionNote: Re-released for DXP Platform.; PackageReference: RB7.6-15; Publisher: Altium Limited; PackageDescription: Polarized Capacitor (Radial); 2 Leads
D1#5 = LED0: Typical INFRARED GaAs LED; Published: 8-Jun-2000; LatestRevisionDate: 08-Jul-2005; LatestRevisionNote: Mech Layer 1 removed.; PackageReference: LED-0; Publisher: Altium Limited; PackageDescription: LED; 2 Leads
E18-MDO#3 = E18-MDO: Zigbee模块
P2#5 P3#5 P4#5 = Header 4: Header, 4-Pin; LatestRevisionDate: 17-Jul-2002; LatestRevisionNote: Re-released for DXP Platform.; Publisher: Altium Limited
P5#3 = Header 2: Header, 2-Pin; LatestRevisionDate: 17-Jul-2002; LatestRevisionNote: Re-released for DXP Platform.; Publisher: Altium Limited
P6#3 = Header 5X2: Header, 5-Pin, Dual row; LatestRevisionDate: 17-Jul-2002; LatestRevisionNote: Re-released for DXP Platform.; Publisher: Altium Limited
P7#3 = Header 2X2H: Header, 2-Pin, Dual row, Right Angle; LatestRevisionDate: 17-Jul-2002; LatestRevisionNote: Re-released for DXP Platform.; Publisher: Altium Limited
R1#4 R2#6 R5#5 R6#5 R9#4 R11#4 R12#4 R13#2 R14#3 R15#3 R16#2 R17#1 R18#1 = R
R10#6 = Res1: Resistor; Published: 8-Jun-2000; LatestRevisionDate: 17-Jul-2002; LatestRevisionNote: Re-released for DXP Platform.; PackageReference: AXIAL-0.3; Publisher: Altium Limited; PackageDescription: Axial Device, Thru-Hole; 2 Leads; 0.3 in Pin Spacing
S1#4 S2#2 = SW-PB: Switch; Published: 24-Mar-1999; LatestRevisionDate: 17-Jul-2002; LatestRevisionNote: Re-released for DXP Platform.; PackageReference: SPST-2; Publisher: Altium Limited; PackageDescription: Switch; 2 Leads
U3#3 = AMS1117
Y1#2 = XTAL: Crystal Oscillator; Published: 8-Jun-2000; LatestRevisionDate: 17-Jul-2002; LatestRevisionNote: Re-released for DXP Platform.; PackageReference: R38; Publisher: Altium Limited; PackageDescription: Crystal, Thru-Hole; 2 Leads; Body 3.1 x 8.2 mm (Dia.xH)

## Sheet 智能家居-窗帘-控制板.SchDoc
size A4
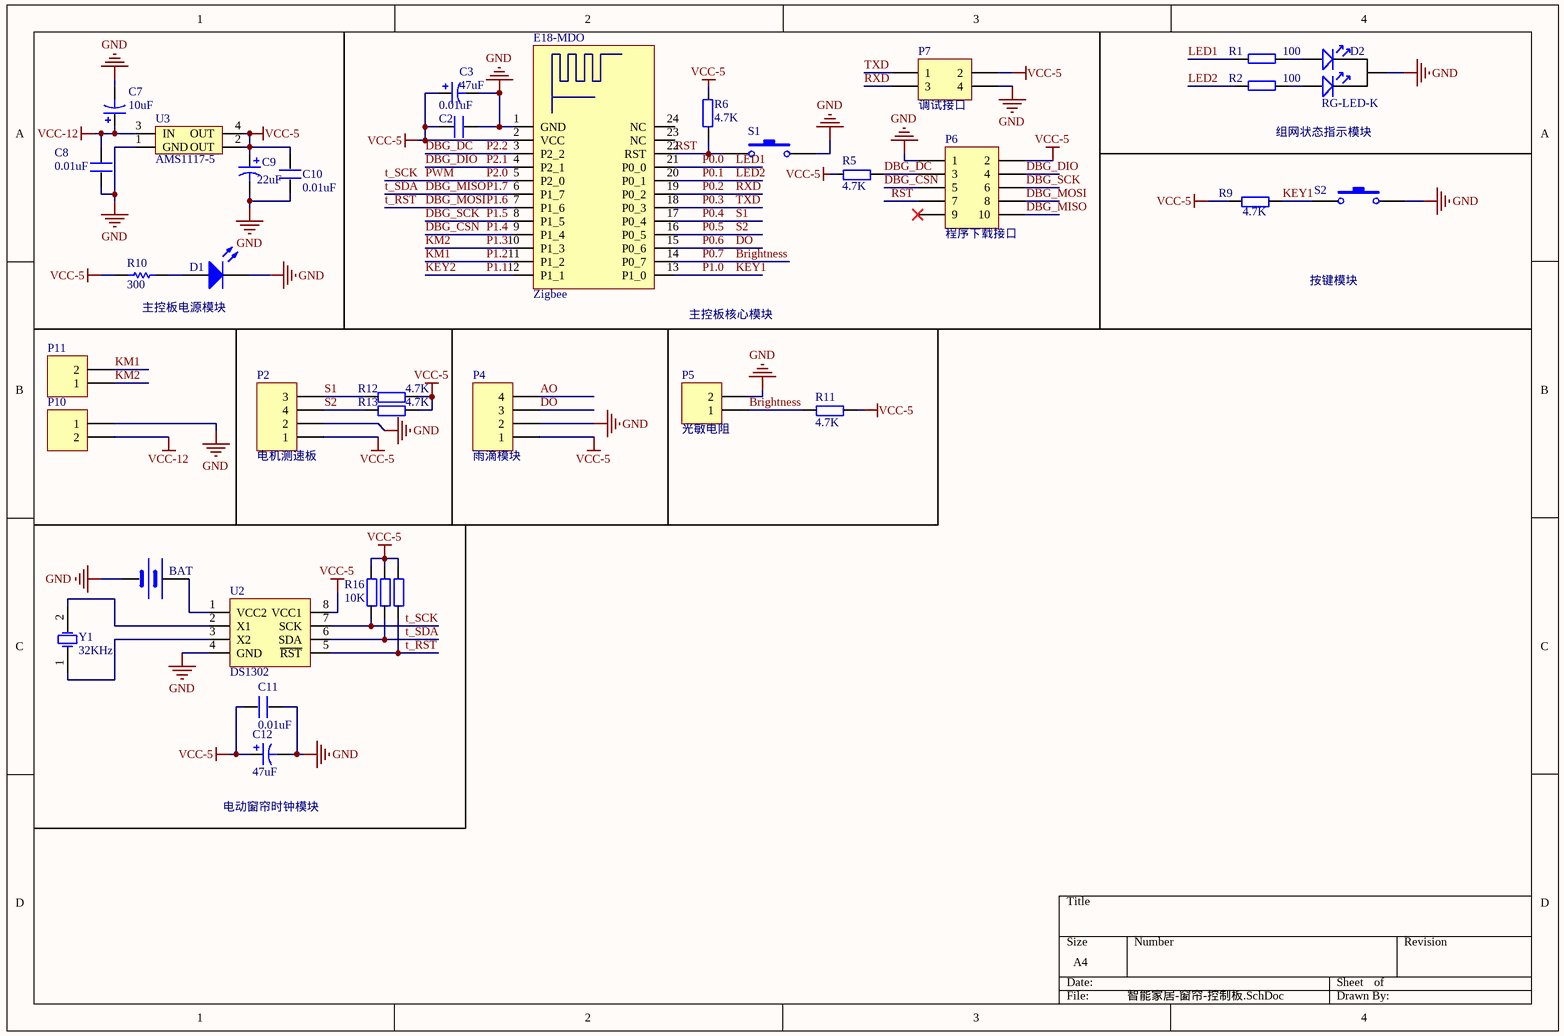
[diagram p7: 智能家居-窗帘-控制板.SchDoc]

### Parts
(Parts that share a designator on the sheet are numbered #1, #2 ... from top to bottom, then left to right.)
BAT#3  BATT  [BATM]  (value not drawn)
C2#8  0.01uF  [0.1UF]
C3#7  value 47uF  [CD5]  (hidden comment: Cap Pol1)
C7#4  value 10uF  [CD5]  (hidden comment: Cap Pol1)
C8#4  0.01uF  [0.1UF]
C9#3  value 22uF  [CD5]  (hidden comment: Cap Pol1)
C10#3  0.01uF  [0.1UF]
C11#2  0.01uF  [0.1UF]
C12#2  value 47uF  [CD5]  (hidden comment: Cap Pol1)
D1#6  LED0  [LED-3]  (value not drawn)
D2#5  RG-LED-K  [RG-LED]
E18-MDO#4  Zigbee  [E18-MD0-1]
P2#6  电机测速板  [HDR1X4]
P4#6  雨滴模块  [DG1284]
P5#4  光敏电阻  [HDR1X2]
P6#4  程序下载接口  [HDR2X5]
P7#4  调试接口  [HDR2X2]
P10  Header 2  [TJC3-2A]  (value not drawn)
P11  Header 2  [TJC3-2A]  (value not drawn)
R1#5  100  [AXIAL-0.3]
R2#7  100  [AXIAL-0.3]
R5#6  4.7K  [AXIAL-0.3]
R6#6  4.7K  [AXIAL-0.3]
R9#5  4.7K  [AXIAL-0.3]
R10#7  value 300  [AXIAL-0.3]  (hidden comment: Res1)
R11#5  4.7K  [AXIAL-0.3]
R12#5  4.7K  [AXIAL-0.4]
R13#3  4.7K  [AXIAL-0.4]
R16#3  10K  [AXIAL-0.3]
R17#2  10K  [AXIAL-0.3]  (value not drawn)
R18#2  10K  [AXIAL-0.3]  (value not drawn)
S1#5  SW-PB  [KEY_M]  (value not drawn)
S2#3  SW-PB  [KEY_M]  (value not drawn)
U2#4  DS1302  [DIP-8N]
U3#4  AMS1117-5  [AMS1117]
Y1#3  32KHz  [3216]

### Nets
GND: BAT#3.2(GND) C2#8.2 C3#7.2 C7#4.2 C8#4.1 C9#3.2 C10#3.1 C11#2.2 C12#2.2 D1#6.2(K) D2#5.2(GND) E18-MDO#4.1(GND) P2#6.2 P4#6.2 P5#4.2 P6#4.1 P7#4.4 P10.1 S1#5.2 S2#3.2 U2#4.4(GND) U3#4.1(GND)
VCC-5: C2#8.1 C3#7.1 C9#3.1 C10#3.2 C11#2.1 C12#2.1 E18-MDO#4.2(VCC) P2#6.1 P4#6.1 P6#4.2 P7#4.2 R5#6.1 R6#6.1 R9#5.1 R10#7.1 R11#5.2 R12#5.2 R13#3.2 R16#3.2 R17#2.2 R18#2.2 U2#4.8(VCC1) U3#4.2(OUT) U3#4.4(OUT)
VCC-12: C7#4.1 C8#4.2 P10.2 U3#4.3(IN)
AO: P4#6.4
Brightness: E18-MDO#4.6(P1_7) E18-MDO#4.14(P0_7) P5#4.1 P6#4.10 R11#5.1 R17#2.1 U2#4.6(SDA)  [also labelled DBG_MISO, P0.7, P1.7, t_SDA]
DBG_CSN: E18-MDO#4.9(P1_4) P6#4.5  [also labelled P1.4]
DBG_DC: E18-MDO#4.3(P2_2) P6#4.3 R5#6.2  [also labelled P2.2]
DBG_DIO: E18-MDO#4.4(P2_1) P6#4.4  [also labelled P2.1]
DBG_MOSI: E18-MDO#4.7(P1_6) E18-MDO#4.13(P1_0) E18-MDO#4.17(P0_4) P2#6.3 P6#4.8 R9#5.2 R12#5.1 R18#2.1 S2#3.1 U2#4.5(~{RST})  [also labelled KEY1, P0.4, P1.0, P1.6, S1, t_RST]
DBG_SCK: E18-MDO#4.8(P1_5) P6#4.6  [also labelled P1.5]
DO: E18-MDO#4.5(P2_0) E18-MDO#4.15(P0_6) P4#6.3 R16#3.1 U2#4.7(SCK)  [also labelled P0.6, P2.0, PWM, t_SCK]
KEY2: E18-MDO#4.12(P1_1) E18-MDO#4.16(P0_5) P2#6.4 R13#3.1  [also labelled P0.5, P1.1, S2]  [project net CF]
KM1: E18-MDO#4.11(P1_2) P11.2  [also labelled P1.2]  [project net CF1]
KM2: E18-MDO#4.10(P1_3) P11.1  [also labelled P1.3]
LED1: E18-MDO#4.21(P0_0) R1#5.2  [also labelled P0.0]
LED2: E18-MDO#4.20(P0_1) R2#7.2  [also labelled P0.1]
P0.2: E18-MDO#4.19(P0_2) P7#4.3  [also labelled RXD]
P0.3: E18-MDO#4.18(P0_3) P7#4.1  [also labelled TXD]
RST: E18-MDO#4.22(RST) P6#4.7 R6#6.2 S1#5.1
NetBAT#3_1: BAT#3.1(VCC) U2#4.1(VCC2)
NetD1#6_1: D1#6.1(A) R10#7.2
NetD2#5_1: D2#5.1(R) R1#5.1
NetD2#5_3: D2#5.3(G) R2#7.1
NetU2#4_2: U2#4.2(X1) Y1#3.2(OSC2)
NetU2#4_3: U2#4.3(X2) Y1#3.1(OSC1)

Not connected (* = marked no-connect by the designer): E18-MDO#4 23(NC) 24(NC); P6#4 9*

### Notes on the sheet
- 组网状态指示模块
- 主控板电源模块
- 按键模块
- 主控板核心模块
- (near C12#2) 电动窗帘时钟模块

### Library data of the parts
BAT#3 = BAT
C2#8 C8#4 C10#3 C11#2 = C
C3#7 C7#4 C9#3 C12#2 = Cap Pol1: Polarized Capacitor (Radial); Published: 8-Jun-2000; LatestRevisionDate: 17-Jul-2002; LatestRevisionNote: Re-released for DXP Platform.; PackageReference: RB7.6-15; Publisher: Altium Limited; PackageDescription: Polarized Capacitor (Radial); 2 Leads
D1#6 = LED0: Typical INFRARED GaAs LED; Published: 8-Jun-2000; LatestRevisionDate: 08-Jul-2005; LatestRevisionNote: Mech Layer 1 removed.; PackageReference: LED-0; Publisher: Altium Limited; PackageDescription: LED; 2 Leads
E18-MDO#4 = E18-MDO: Zigbee模块
P2#6 P4#6 = Header 4: Header, 4-Pin; LatestRevisionDate: 17-Jul-2002; LatestRevisionNote: Re-released for DXP Platform.; Publisher: Altium Limited
P5#4 P10 P11 = Header 2: Header, 2-Pin; LatestRevisionDate: 17-Jul-2002; LatestRevisionNote: Re-released for DXP Platform.; Publisher: Altium Limited
P6#4 = Header 5X2: Header, 5-Pin, Dual row; LatestRevisionDate: 17-Jul-2002; LatestRevisionNote: Re-released for DXP Platform.; Publisher: Altium Limited
P7#4 = Header 2X2H: Header, 2-Pin, Dual row, Right Angle; LatestRevisionDate: 17-Jul-2002; LatestRevisionNote: Re-released for DXP Platform.; Publisher: Altium Limited
R1#5 R2#7 R5#6 R6#6 R9#5 R11#5 R12#5 R13#3 R16#3 R17#2 R18#2 = R
R10#7 = Res1: Resistor; Published: 8-Jun-2000; LatestRevisionDate: 17-Jul-2002; LatestRevisionNote: Re-released for DXP Platform.; PackageReference: AXIAL-0.3; Publisher: Altium Limited; PackageDescription: Axial Device, Thru-Hole; 2 Leads; 0.3 in Pin Spacing
S1#5 S2#3 = SW-PB: Switch; Published: 24-Mar-1999; LatestRevisionDate: 17-Jul-2002; LatestRevisionNote: Re-released for DXP Platform.; PackageReference: SPST-2; Publisher: Altium Limited; PackageDescription: Switch; 2 Leads
U3#4 = AMS1117
Y1#3 = XTAL: Crystal Oscillator; Published: 8-Jun-2000; LatestRevisionDate: 17-Jul-2002; LatestRevisionNote: Re-released for DXP Platform.; PackageReference: R38; Publisher: Altium Limited; PackageDescription: Crystal, Thru-Hole; 2 Leads; Body 3.1 x 8.2 mm (Dia.xH)

## Sheet 智能家居-开关-电力板.SchDoc
size A4
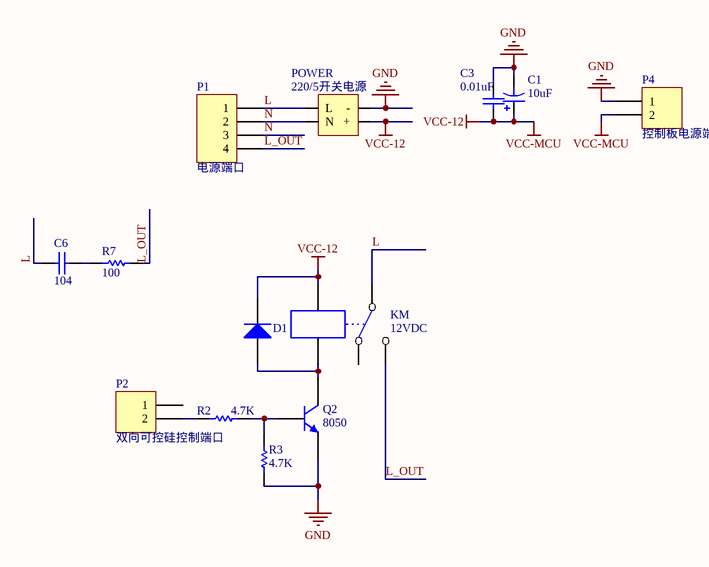
[diagram p8: 智能家居-开关-电力板.SchDoc]

### Parts
(Parts that share a designator on the sheet are numbered #1, #2 ... from top to bottom, then left to right.)
C1#5  value 10uF  [CD5]  (hidden comment: Cap Pol1)
C3#8  0.01uF  [0.1UF]
C6#5  value 104  [0.1UF/275V]  (hidden comment: Cap)
D1#7  Diode  [DIODE]  (value not drawn)
KM  12VDC  [SRD_RELAY]
P1#6  电源端口  [JK128-500-4P]
P2#7  双向可控硅控制端口  [TJC3-2A]
P4#7  控制板电源端口  [TJC3-2A]
POWER#3  220/5开关电源  [220/5开关电源]
Q2#3  8050  [TO-92D]
R2#8  4.7K  [AXIAL0.3]
R3#5  4.7K  [AXIAL0.3]
R7#6  100  [AXIAL0.3]

### Nets
GND: C1#5.2 C3#8.2 P4#7.1 POWER#3.3(-) Q2#3.1(E) R3#5.2
VCC-12: C1#5.1 C3#8.1 D1#7.2(K) KM.1 P4#7.2 POWER#3.4(+)  [also labelled VCC-MCU]
L: C6#5.2 KM.5(COM) P1#6.1 POWER#3.1(L)
L_OUT: KM.3 P1#6.4 R7#6.1
N: P1#6.2 P1#6.3 POWER#3.2(N)
NetC6#5_1: C6#5.1 R7#6.2
NetD1#7_1: D1#7.1(A) KM.4 Q2#3.3(C)
NetP2#7_2: P2#7.2 R2#8.1
NetQ2#3_2: Q2#3.2(B) R2#8.2 R3#5.1

Not connected (* = marked no-connect by the designer): KM 2; P2#7 1

### Library data of the parts
C1#5 = Cap Pol1: Polarized Capacitor (Radial); Published: 8-Jun-2000; LatestRevisionDate: 17-Jul-2002; LatestRevisionNote: Re-released for DXP Platform.; PackageReference: RB7.6-15; Publisher: Altium Limited; PackageDescription: Polarized Capacitor (Radial); 2 Leads
C3#8 C6#5 = Cap: Capacitor; Published: 8-Jun-2000; LatestRevisionDate: 17-Jul-2002; LatestRevisionNote: Re-released for DXP Platform.; Publisher: Altium Limited; PackageDescription: Radial Cap, Thru-Hole; 2 Leads; 0.3 in Pin Spacing
  C3#8: PackageReference: 0.1UF; Value: 0.01uF
  C6#5: PackageReference: RAD-0.3
D1#7 = Diode: Default Diode; Published: 8-Jun-2000; LatestRevisionDate: 17-Jul-2002; LatestRevisionNote: Re-released for DXP Platform.; PackageVersion: Sep-1996; PackageReference: SMC; Publisher: Altium Limited; PackageDescription: DO-214-AB/SMC; 2 C-Bend Leads; Body 7.9 x 5.9 mm, inc. leads (LxW); Code_JEDEC: DO-214-AB
KM = SRD-12VDC
P1#6 = Header 4: Header, 4-Pin; LatestRevisionDate: 17-Jul-2002; LatestRevisionNote: Re-released for DXP Platform.; Publisher: Altium Limited
P2#7 P4#7 = Header 2: Header, 2-Pin; LatestRevisionDate: 17-Jul-2002; LatestRevisionNote: Re-released for DXP Platform.; Publisher: Altium Limited
Q2#3 = NPN: NPN Bipolar Transistor; Published: 8-Jun-2000; LatestRevisionDate: 17-Jul-2002; LatestRevisionNote: Re-released for DXP Platform.; PackageReference: TO-226-AA; Publisher: Altium Limited; PackageDescription: TO, Flat Index; 3 In-Line, Axial Leads; Body Dia. 4.8mm; Leads 0.55 x 0.51 mm (max); Code_JEDEC: TO-226-AA
R2#8 R3#5 R7#6 = Res1: Resistor; Value: 1K; Published: 8-Jun-2000; Revision: July-2002: Re-released for DXP Platform.; Publisher: Altium Limited

## Sheet 智能家居-开关-主控板.SchDoc
size A4
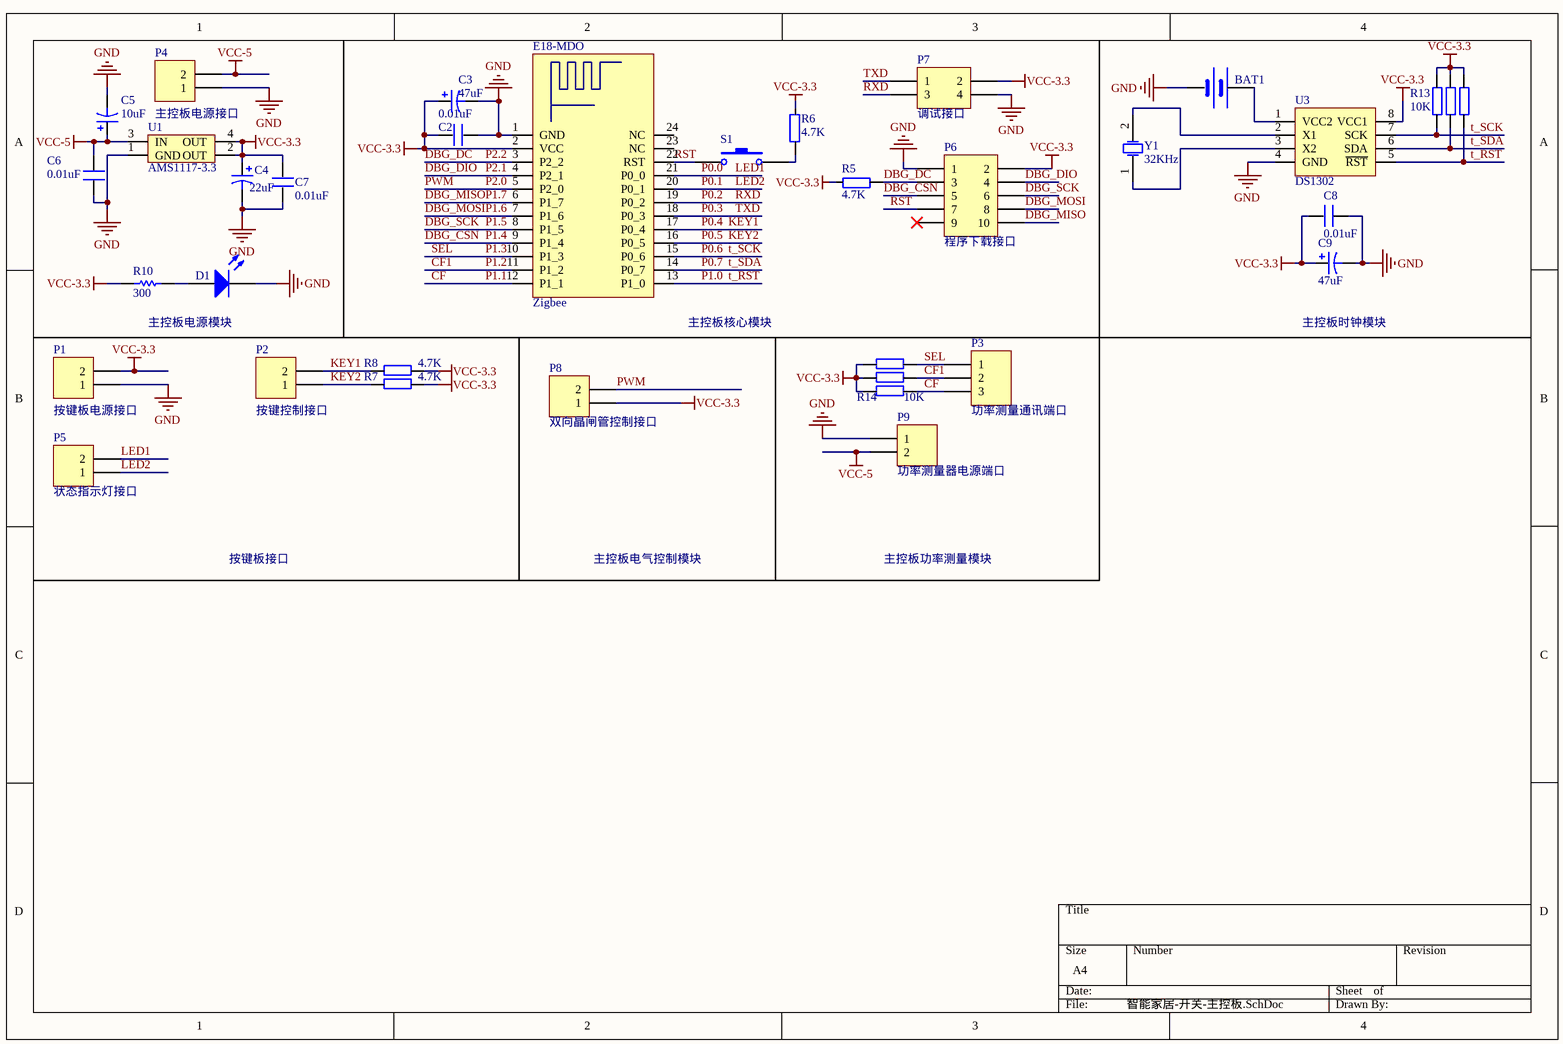
[diagram p9: 智能家居-开关-主控板.SchDoc]

### Parts
(Parts that share a designator on the sheet are numbered #1, #2 ... from top to bottom, then left to right.)
BAT1#2  BATT  [BATM]  (value not drawn)
C2#9  0.01uF  [0.1UF]
C3#9  value 47uF  [CD5]  (hidden comment: Cap Pol1)
C4#6  value 22uF  [CD5]  (hidden comment: Cap Pol1)
C5#4  value 10uF  [CD5]  (hidden comment: Cap Pol1)
C6#6  0.01uF  [0.1UF]
C7#5  0.01uF  [0.1UF]
C8#5  0.01uF  [0.1UF]
C9#4  value 47uF  [CD5]  (hidden comment: Cap Pol1)
D1#8  LED0  [LED-3]  (value not drawn)
E18-MDO#5  Zigbee  [E18-MD0-1]
P1#7  按键板电源接口  [DG1282]
P2#8  按键控制接口  [DG1282]
P3#6  功率测量通讯端口  [DG1283]
P4#8  主控板电源接口  [DG1282]
P5#5  状态指示灯接口  [DG1282]
P6#5  程序下载接口  [HDR2X5]
P7#5  调试接口  [HDR2X2]
P8#2  双向晶闸管控制接口  [DG1282]
P9#2  功率测量器电源端口  [DG1282]
R5#7  4.7K  [AXIAL-0.3]
R6#7  4.7K  [AXIAL-0.3]
R7#7  4.7K  [AXIAL-0.3]
R8#3  4.7K  [AXIAL-0.3]
R10#8  value 300  [AXIAL-0.3]  (hidden comment: Res1)
R11#6  10K  [AXIAL-0.3]  (value not drawn)
R12#6  10K  [AXIAL-0.3]  (value not drawn)
R13#4  10K  [AXIAL-0.3]
R14#4  10K  [AXIAL-0.3]
R15#4  10K  [AXIAL-0.3]  (value not drawn)
R16#4  10K  [AXIAL-0.3]  (value not drawn)
S1#6  SW-PB  [KEY_M]  (value not drawn)
U1#5  AMS1117-3.3  [AMS1117]
U3#5  DS1302  [DIP-8N]
Y1#4  32KHz  [3216]

### Nets
GND: BAT1#2.2(GND) C2#9.2 C3#9.2 C4#6.2 C5#4.2 C6#6.1 C7#5.1 C8#5.2 C9#4.2 D1#8.2(K) E18-MDO#5.1(GND) P1#7.1 P4#8.1 P6#5.1 P7#5.4 P9#2.1 U1#5.1(GND) U3#5.4(GND)
VCC-3.3: C2#9.1 C3#9.1 C4#6.1 C7#5.2 C8#5.1 C9#4.1 E18-MDO#5.2(VCC) P1#7.2 P6#5.2 P7#5.2 P8#2.1 R5#7.1 R6#7.1 R7#7.1 R8#3.1 R10#8.1 R11#6.2 R12#6.2 R13#4.2 R14#4.2 R15#4.2 R16#4.2 U1#5.2(OUT) U1#5.4(OUT) U3#5.8(VCC1)
VCC-5: C5#4.1 C6#6.2 P4#8.2 P9#2.2 U1#5.3(IN)
CF: E18-MDO#5.12(P1_1) E18-MDO#5.16(P0_5) P2#8.1 P3#6.3 R7#7.2 R14#4.1  [also labelled KEY2, P0.5, P1.1]
CF1: E18-MDO#5.11(P1_2) P3#6.2 R15#4.1  [also labelled P1.2]
DBG_CSN: E18-MDO#5.9(P1_4) P6#5.5  [also labelled P1.4]
DBG_DC: E18-MDO#5.3(P2_2) P6#5.3 R5#7.2  [also labelled P2.2]
DBG_DIO: E18-MDO#5.4(P2_1) P6#5.4  [also labelled P2.1]
DBG_MISO: E18-MDO#5.6(P1_7) E18-MDO#5.14(P0_7) P6#5.10 R12#6.1 U3#5.6(SDA)  [also labelled P0.7, P1.7, t_SDA]  [project net Brightness]
DBG_MOSI: E18-MDO#5.7(P1_6) E18-MDO#5.13(P1_0) E18-MDO#5.17(P0_4) P2#8.2 P6#5.8 R8#3.2 R11#6.1 U3#5.5(~{RST})  [also labelled KEY1, P0.4, P1.0, P1.6, t_RST]
DBG_SCK: E18-MDO#5.8(P1_5) P6#5.6  [also labelled P1.5]
LED1: E18-MDO#5.21(P0_0) P5#5.2  [also labelled P0.0]
LED2: E18-MDO#5.20(P0_1) P5#5.1  [also labelled P0.1]
P0.2: E18-MDO#5.19(P0_2) P7#5.3  [also labelled RXD]
P0.3: E18-MDO#5.18(P0_3) P7#5.1  [also labelled TXD]
P0.6: E18-MDO#5.5(P2_0) E18-MDO#5.15(P0_6) P8#2.2 R13#4.1 U3#5.7(SCK)  [also labelled P2.0, PWM, t_SCK]  [project net DO]
P1.3: E18-MDO#5.10(P1_3) P3#6.1 R16#4.1  [also labelled SEL]  [project net KM2]
RST: E18-MDO#5.22(RST) P6#5.7 S1#6.1
NetBAT1#2_1: BAT1#2.1(VCC) U3#5.1(VCC2)
NetD1#8_1: D1#8.1(A) R10#8.2
NetR6#7_2: R6#7.2 S1#6.2
NetU3#5_2: U3#5.2(X1) Y1#4.2(OSC2)
NetU3#5_3: U3#5.3(X2) Y1#4.1(OSC1)

Not connected (* = marked no-connect by the designer): E18-MDO#5 23(NC) 24(NC); P6#5 9*

### Notes on the sheet
- 主控板电源模块
- (near E18-MDO#5) 主控板核心模块
- 主控板时钟模块
- 按键板接口
- 主控板电气控制模块
- 主控板功率测量模块

### Library data of the parts
BAT1#2 = BAT
C2#9 C6#6 C7#5 C8#5 = C
C3#9 C4#6 C5#4 C9#4 = Cap Pol1: Polarized Capacitor (Radial); Published: 8-Jun-2000; LatestRevisionDate: 17-Jul-2002; LatestRevisionNote: Re-released for DXP Platform.; PackageReference: RB7.6-15; Publisher: Altium Limited; PackageDescription: Polarized Capacitor (Radial); 2 Leads
D1#8 = LED0: Typical INFRARED GaAs LED; Published: 8-Jun-2000; LatestRevisionDate: 08-Jul-2005; LatestRevisionNote: Mech Layer 1 removed.; PackageReference: LED-0; Publisher: Altium Limited; PackageDescription: LED; 2 Leads
E18-MDO#5 = E18-MDO: Zigbee模块
P1#7 P2#8 P4#8 P5#5 P8#2 P9#2 = Header 2H: Header, 2-Pin, Right Angle; LatestRevisionDate: 17-Jul-2002; LatestRevisionNote: Re-released for DXP Platform.; Publisher: Altium Limited
P3#6 = Header 3: Header, 3-Pin; LatestRevisionDate: 17-Jul-2002; LatestRevisionNote: Re-released for DXP Platform.; Publisher: Altium Limited
P6#5 = Header 5X2: Header, 5-Pin, Dual row; LatestRevisionDate: 17-Jul-2002; LatestRevisionNote: Re-released for DXP Platform.; Publisher: Altium Limited
P7#5 = Header 2X2H: Header, 2-Pin, Dual row, Right Angle; LatestRevisionDate: 17-Jul-2002; LatestRevisionNote: Re-released for DXP Platform.; Publisher: Altium Limited
R5#7 R6#7 R7#7 R8#3 R11#6 R12#6 R13#4 R14#4 R15#4 R16#4 = R
R10#8 = Res1: Resistor; Published: 8-Jun-2000; LatestRevisionDate: 17-Jul-2002; LatestRevisionNote: Re-released for DXP Platform.; PackageReference: AXIAL-0.3; Publisher: Altium Limited; PackageDescription: Axial Device, Thru-Hole; 2 Leads; 0.3 in Pin Spacing
S1#6 = SW-PB: Switch; Published: 24-Mar-1999; LatestRevisionDate: 17-Jul-2002; LatestRevisionNote: Re-released for DXP Platform.; PackageReference: SPST-2; Publisher: Altium Limited; PackageDescription: Switch; 2 Leads
U1#5 = AMS1117
Y1#4 = XTAL: Crystal Oscillator; Published: 8-Jun-2000; LatestRevisionDate: 17-Jul-2002; LatestRevisionNote: Re-released for DXP Platform.; PackageReference: R38; Publisher: Altium Limited; PackageDescription: Crystal, Thru-Hole; 2 Leads; Body 3.1 x 8.2 mm (Dia.xH)

## Nets that join several sheets
GND: 智能家居-开关-功率测量板 (6 pins), 智能家居-电灯-电力板 (9 pins), 智能家居-电灯-主控板 (20 pins), 智能家居-网关 (22 pins), 智能家居-温湿度传感器 (11 pins), 智能家居-窗帘-电力板 (8 pins), 智能家居-窗帘 (23 pins), 智能家居-窗帘-控制板 (22 pins), 智能家居-开关-电力板 (6 pins), 智能家居-开关-主控板 (18 pins)
VCC-3.3: 智能家居-网关 (20 pins), 智能家居-开关-主控板 (25 pins)
VCC-5: 智能家居-开关-功率测量板 (C1#1.2 C2#1.1 P2#1.2 U1#1.1), 智能家居-电灯-电力板 (5 pins), 智能家居-电灯-主控板 (26 pins), 智能家居-网关 (C1#3.1 C2#4.2 P1#4.2 U3#2.3), 智能家居-窗帘 (24 pins), 智能家居-窗帘-控制板 (24 pins), 智能家居-开关-主控板 (5 pins)
VCC-12: 智能家居-电灯-电力板 (C1#2.1 C3#2.1 POWER#1.4 U1#2.3), 智能家居-电灯-主控板 (C5#2.1 C6#2.2 P4#2.2 U1#3.3), 智能家居-窗帘-电力板 (8 pins), 智能家居-窗帘 (C7#3.1 C8#3.2 P3#5.1 U3#3.3), 智能家居-窗帘-控制板 (C7#4.1 C8#4.2 P10.2 U3#4.3), 智能家居-开关-电力板 (6 pins)
AO: 智能家居-窗帘 (P4#5.4), 智能家居-窗帘-控制板 (P4#6.4)
Brightness: 智能家居-电灯-主控板 (5 pins), 智能家居-网关 (P2#4.3 P3#3.10 U1#4.6 U1#4.14), 智能家居-温湿度传感器 (E18-MDO#2.6 E18-MDO#2.14 P6#2.10), 智能家居-窗帘 (7 pins), 智能家居-窗帘-控制板 (7 pins), 智能家居-开关-主控板 (5 pins)
CF: 智能家居-开关-功率测量板 (P1#1.3 U1#1.6), 智能家居-电灯-主控板 (6 pins), 智能家居-网关 (R10#3.2 S2#1.1 U1#4.12 U1#4.16), 智能家居-温湿度传感器 (E18-MDO#2.12 E18-MDO#2.16), 智能家居-窗帘 (E18-MDO#3.12 E18-MDO#3.16 P2#5.4 R13#2.1), 智能家居-窗帘-控制板 (E18-MDO#4.12 E18-MDO#4.16 P2#6.4 R13#3.1), 智能家居-开关-主控板 (6 pins)
CF1: 智能家居-开关-功率测量板 (P1#1.2 U1#1.7), 智能家居-电灯-主控板 (E18-MDO#1.11 P3#2.2 R15#2.1), 智能家居-网关 (U1#4.11), 智能家居-温湿度传感器 (E18-MDO#2.11), 智能家居-窗帘 (E18-MDO#3.11 P3#5.4 R14#3.1), 智能家居-窗帘-控制板 (E18-MDO#4.11 P11.2), 智能家居-开关-主控板 (E18-MDO#5.11 P3#6.2 R15#4.1)
DBG_CSN: 智能家居-电灯-主控板 (E18-MDO#1.9 P6#1.5), 智能家居-网关 (P3#3.5 U1#4.9), 智能家居-温湿度传感器 (E18-MDO#2.9 P6#2.5), 智能家居-窗帘 (E18-MDO#3.9 P6#3.5), 智能家居-窗帘-控制板 (E18-MDO#4.9 P6#4.5), 智能家居-开关-主控板 (E18-MDO#5.9 P6#5.5)
DBG_DC: 智能家居-电灯-主控板 (E18-MDO#1.3 P6#1.3 R5#2.2), 智能家居-网关 (P3#3.3 R3#2.2 U1#4.3), 智能家居-温湿度传感器 (E18-MDO#2.3 P6#2.3 R5#4.2), 智能家居-窗帘 (E18-MDO#3.3 P6#3.3 R5#5.2), 智能家居-窗帘-控制板 (E18-MDO#4.3 P6#4.3 R5#6.2), 智能家居-开关-主控板 (E18-MDO#5.3 P6#5.3 R5#7.2)
DBG_DIO: 智能家居-电灯-主控板 (E18-MDO#1.4 P6#1.4), 智能家居-网关 (P3#3.4 U1#4.4), 智能家居-温湿度传感器 (E18-MDO#2.4 P6#2.4), 智能家居-窗帘 (E18-MDO#3.4 P6#3.4), 智能家居-窗帘-控制板 (E18-MDO#4.4 P6#4.4), 智能家居-开关-主控板 (E18-MDO#5.4 P6#5.4)
DBG_MOSI: 智能家居-电灯-主控板 (8 pins), 智能家居-网关 (7 pins), 智能家居-温湿度传感器 (6 pins), 智能家居-窗帘 (10 pins), 智能家居-窗帘-控制板 (10 pins), 智能家居-开关-主控板 (8 pins)
DBG_SCK: 智能家居-电灯-主控板 (E18-MDO#1.8 P6#1.6), 智能家居-网关 (P3#3.6 U1#4.8), 智能家居-温湿度传感器 (E18-MDO#2.8 P6#2.6), 智能家居-窗帘 (E18-MDO#3.8 P6#3.6), 智能家居-窗帘-控制板 (E18-MDO#4.8 P6#4.6), 智能家居-开关-主控板 (E18-MDO#5.8 P6#5.6)
DO: 智能家居-电灯-主控板 (5 pins), 智能家居-网关 (U1#4.5 U1#4.15), 智能家居-温湿度传感器 (E18-MDO#2.5 E18-MDO#2.15), 智能家居-窗帘 (5 pins), 智能家居-窗帘-控制板 (5 pins), 智能家居-开关-主控板 (5 pins)
KM2: 智能家居-开关-功率测量板 (P1#1.1 U1#1.8), 智能家居-电灯-主控板 (E18-MDO#1.10 P3#2.1 R16#1.1), 智能家居-网关 (U1#4.10), 智能家居-温湿度传感器 (E18-MDO#2.10), 智能家居-窗帘 (E18-MDO#3.10 P3#5.3 R15#3.1), 智能家居-窗帘-控制板 (E18-MDO#4.10 P11.1), 智能家居-开关-主控板 (E18-MDO#5.10 P3#6.1 R16#4.1)
L: 智能家居-电灯-电力板 (5 pins), 智能家居-窗帘-电力板 (5 pins), 智能家居-开关-电力板 (C6#5.2 KM.5 P1#6.1 POWER#3.1)
L_OUT: 智能家居-开关-功率测量板 (5 pins), 智能家居-电灯-电力板 (P1#2.4 Q1.1 R7#2.1 R15#1.1), 智能家居-开关-电力板 (KM.3 P1#6.4 R7#6.1)
LED1: 智能家居-电灯-主控板 (E18-MDO#1.21 P5#1.2), 智能家居-网关 (R9#2.2 U1#4.21), 智能家居-温湿度传感器 (E18-MDO#2.21 R1#3.2), 智能家居-窗帘 (E18-MDO#3.21 R1#4.2), 智能家居-窗帘-控制板 (E18-MDO#4.21 R1#5.2), 智能家居-开关-主控板 (E18-MDO#5.21 P5#5.2)
LED2: 智能家居-电灯-主控板 (E18-MDO#1.20 P5#1.1), 智能家居-网关 (R8#2.2 U1#4.20), 智能家居-温湿度传感器 (E18-MDO#2.20 R2#4.2), 智能家居-窗帘 (E18-MDO#3.20 R2#6.2), 智能家居-窗帘-控制板 (E18-MDO#4.20 R2#7.2), 智能家居-开关-主控板 (E18-MDO#5.20 P5#5.1)
N: 智能家居-开关-功率测量板 (P3#1.3 R4.2), 智能家居-电灯-电力板 (P1#2.2 P1#2.3 POWER#1.2), 智能家居-窗帘-电力板 (C6#4.2 P1#5.2 P1#5.3 POWER#2.2), 智能家居-开关-电力板 (P1#6.2 P1#6.3 POWER#3.2)
P0.2: 智能家居-电灯-主控板 (E18-MDO#1.19 P7#1.3), 智能家居-网关 (P4#3.1 U1#4.19 U2#1.16), 智能家居-温湿度传感器 (E18-MDO#2.19 P7#2.3), 智能家居-窗帘 (E18-MDO#3.19 P7#3.3), 智能家居-窗帘-控制板 (E18-MDO#4.19 P7#4.3), 智能家居-开关-主控板 (E18-MDO#5.19 P7#5.3)
P0.3: 智能家居-电灯-主控板 (E18-MDO#1.18 P7#1.1), 智能家居-网关 (P4#3.3 U1#4.18 U2#1.15), 智能家居-温湿度传感器 (E18-MDO#2.18 P7#2.1), 智能家居-窗帘 (E18-MDO#3.18 P7#3.1), 智能家居-窗帘-控制板 (E18-MDO#4.18 P7#4.1), 智能家居-开关-主控板 (E18-MDO#5.18 P7#5.1)
RST: 智能家居-电灯-主控板 (E18-MDO#1.22 P6#1.7 R6#2.2 S1#1.1), 智能家居-网关 (P3#3.7 R2#3.2 S1#2.1 U1#4.22), 智能家居-温湿度传感器 (E18-MDO#2.22 P6#2.7 S1#3.1), 智能家居-窗帘 (E18-MDO#3.22 P6#3.7 S1#4.1), 智能家居-窗帘-控制板 (E18-MDO#4.22 P6#4.7 R6#6.2 S1#5.1), 智能家居-开关-主控板 (E18-MDO#5.22 P6#5.7 S1#6.1)